# Altium project Power Distribution Board.PrjPcb (part 1 of 2)
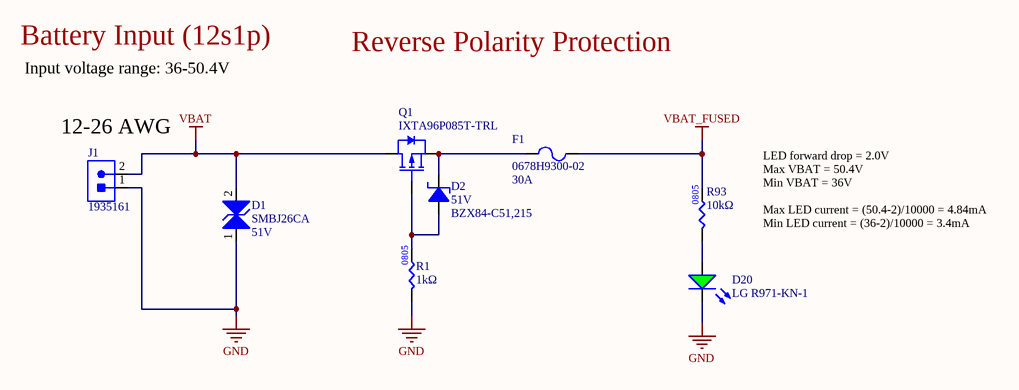
[diagram p0: SH1 - POWER.SchDoc]
11 sheets, 242 parts. Net scope: flat (ports and power ports of the same name join across sheets).
Board files: Power Distribution Board.PcbDoc, High Speed Sample.PcbDoc
Sheets:
  SH1 - POWER.SchDoc
  SH2 - 17V BUCK CONVERTER.SchDoc
  SH3 - 5V BUCK CONVERTER.SchDoc
  SH4 - 3.3V LINEAR REGULATOR.SchDoc
  SH5 - LOAD MONITORING 1.SchDoc
  SH6 - LOAD MONITORING 2.SchDoc
  SH7 - MICROCONTROLLER.SchDoc
  SH8 - CAN.SchDoc
  SH9 - RS-485.SchDoc
  SH10 - BMS.SchDoc
  SH11 - Battery Balancing.SchDoc

## Sheet SH1 - POWER.SchDoc: Power
size B; CheckedBy: Cindy Li; Engineer: Farris Matar; Organization: UW Robotics; Address1: 200 University Avenue; Address2: Waterloo; Address3: Ontario; Address4: Canada N2L 3G6; DocumentNumber: 1; Revision: 3; SheetNumber: 1; SheetTotal: 9

### Parts
D1  Manufacturer Part Number 1: SMBJ26CA  Voltage - Reverse Standoff (Typ): 51V  [TVS_DIODE_BIDIR_SMB]  (hidden comment: TVS_DIODE_BIDIR_51V)
D2  Manufacturer Part Number 1: BZX84-C51,215  Working Voltage: 51V  [SOT23-3]  (hidden comment: DIO_ZENER_51V)
D20  Manufacturer Part Number 1: LG R971-KN-1  [LED_0805_GREEN]  (hidden comment: LED_GREEN)
F1  Manufacturer Part Number 1: 0678H9300-02  Current Rating: 30A  [FUSE_3912]  (hidden comment: FUSE_30A_3912)
J1  CON_2M_TERM  [1935161]  (value not drawn)
Q1  Manufacturer Part Number 1: IXTA96P085T-TRL  [D-PAK]  (hidden comment: PMOS_85V_96A)
R1  value 1kΩ  [RES0805]  (hidden comment: RES_1kΩ_0805_1%)
R93  value 10kΩ  [RES0805]  (hidden comment: RES_10kΩ_0805_5%)

### Nets
GND: D1.1 D20.2(K) J1.1 R1.1  [project net AGND]
VBAT: D1.2 J1.2 Q1.1(Drain)
VBAT_FUSED: F1.2 R93.2
NetD2_1: D2.1(Anode) Q1.2(Gate) R1.2
NetD2_3: D2.3(Cathode) F1.1 Q1.3(Source)
NetD20_1: D20.1(A) R93.1

### Notes on the sheet
- Battery Input (12s1p)
- Input voltage range: 36-50.4V
- Reverse Polarity Protection
- (near J1) 12-26 AWG
- LED forward drop = 2.0V
  Max VBAT = 50.4V
  Min VBAT = 36V
  Max LED current = (50.4-2)/10000 = 4.84mA
  Min LED current = (36-2)/10000 = 3.4mA
- Title:
- Project:
- Date:
- Rev:
- Reviewer:
- Engineer:
- Sheet:
- of

### Library data of the parts
D1 = TVS_DIODE_BIDIR_51V: TVS DIODE 51VWM 82.4VC DO214AA; Manufacturer 1: Littelfuse; Package/Footprint: SMB; Voltage - Clamping (Max) @ Ipp: 82.4V; Voltage - Breakdown (Min): 56.7V; Supplier 1: Digi-Key; Supplier Part Number 1: SMBJ51CALFCT-ND; Mounting Type: SMD
D2 = DIO_ZENER_51V: DIODE ZENER 51V 250MW TO236AB; Manufacturer 1: Nexperia USA Inc.; Forward Voltage: 0.9V; Supplier Part Number 1: 1727-5037-1-ND; Supplier 1: Digi-Key; Package/Case: SOT-23-3
D20 = LED_GREEN: LED GREEN DIFFUSED 0805 SMD; Manufacturer 1: OSRAM; Forward Voltage Drop: 2.2V; Package/Footprint: 0805; Supplier Part Number 1: 475-1410-1-ND; Supplier 1: Digi-Key; Mounting Type: SMD
F1 = FUSE_30A_3912: FUSE SMT 3912 ENH BRK 250V 30A; Manufacturer 1: Bel Fuse Inc.; Package/Footprint: 3912; Supplier 1: Digi-Key; Supplier Part Number 1: 507-2254-1-ND; Mounting Type: SMD; Verified: No
J1 = CON_2M_TERM: TERM BLK 2POS SIDE ENTRY 5MM; Manufacturer 1: Phoenix Contact; Voltage: 300V; Current: 18A; Max Current Rating: 16A; Package/Footprint: SMD; Supplier 1: Digi-Key; Manufacturer Part Number 1: 1935161; Supplier Part Number 1: 277-1667-ND; Mounting Type: TH
Q1 = PMOS_85V_96A: MOSFET P-CH 85V 96A TO263; Manufacturer 1: IXYS; Package/Footprint: TO-263AA; Vgs (Max): ±15V; Mounting Type: SMD; Verified: No; Supplier 1: Digi-Key; Supplier Part Number 1: IXTA96P085T-TRLCT-ND; Id: 96A; Vdss: 85V
R1 = RES_1kΩ_0805_1%: RES 1K OHM 1% 1/8W 0805; Manufacturer 1: Yageo; Manufacturer Part Number 1: RC0805FR-071KL; Package: 0805; Supplier Part Number 1: 311-1.00KCRCT-ND; Supplier 1: Digi-Key; Mounting Type: SMD; LCSC Part #: C17513
R93 = RES_10kΩ_0805_5%: RES 10K OHM 5% 1/8W 0805; Manufacturer 1: Panasonic Electronic Components; Manufacturer Part Number 1: ERJ-6GEYJ103V; Package/Footprint: 0805; Supplier Part Number 1: P10KACT-ND; Supplier 1: Digi-Key; LCSC Part #: C17414; Mounting Type: SMD

## Sheet SH2 - 17V BUCK CONVERTER.SchDoc: 17V Buck Converter
size B; CheckedBy: Cindy Li; Engineer: Farris Matar; Organization: UW Robotics; Address1: 200 University Avenue; Address2: Waterloo; Address3: Ontario; Address4: Canada N2L 3G6; DocumentNumber: 2; Revision: 3; SheetNumber: 2; SheetTotal: 9
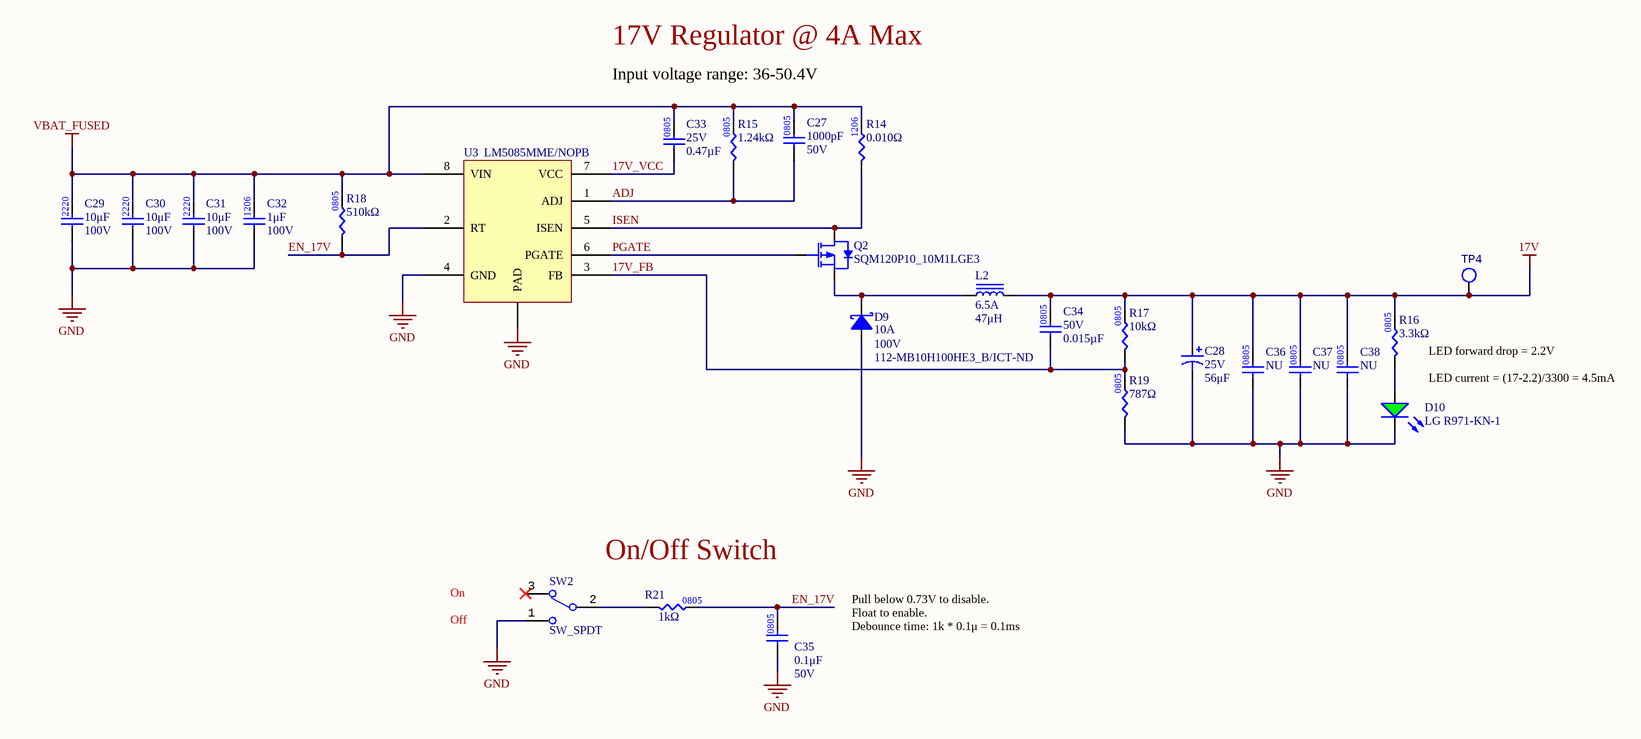
[diagram p1: SH2 - 17V BUCK CONVERTER.SchDoc]

### Parts
C27  value 1000pF  Voltage Rating: 50V  [CAP2012]  (hidden comment: CAP_1000pF_50V_0805)
C28  value 56μF  Voltage Rating: 25V  [RADIAL_PANASONIC_D]  (hidden comment: CAP_56uF_25V_ALUM)
C29  value 10μF  Voltage Rating: 100V  [CAP2220]  (hidden comment: CAP_10μF_100V_2220)
C30  value 10μF  Voltage Rating: 100V  [CAP2220]  (hidden comment: CAP_10μF_100V_2220)
C31  value 10μF  Voltage Rating: 100V  [CAP2220]  (hidden comment: CAP_10μF_100V_2220)
C32  value 1μF  Voltage Rating: 100V  [CAPC3216X190X50NL20T25]  (hidden comment: CAP_1uF_100V_1206)
C33  value 0.47µF  Voltage Rating: 25V  [CAP0805]  (hidden comment: CAP_0.47uF_25V_0805)
C34  value 0.015µF  Voltage Rating: 50V  [CAP0805]  (hidden comment: CAP_0.015uF_50V_0805)
C35  value 0.1μF  Voltage Rating: 50V  [CAP2012]  (hidden comment: CAP_0.1uF_50V_0805)
C36  value NU  [CAP0805]  (hidden comment: CAP_NU_0805)
C37  value NU  [CAP0805]  (hidden comment: CAP_NU_0805)
C38  value NU  [CAP0805]  (hidden comment: CAP_NU_0805)
D9  Vr (Max): 100V  Supplier Part Number 1: 112-MB10H100HE3_B/ICT-ND  Forward Current: 10A  [D-PAK3]  (hidden comment: DIO_SCHOTTKY_100V_5.5A)
D10  Manufacturer Part Number 1: LG R971-KN-1  [LED_0805_GREEN]  (hidden comment: LED_GREEN)
L2  Current Rating: 6.5A  Inductance: 47μH  [IND_BOURNS_SRP1265]  (hidden comment: IND_47uH_6.5A)
Q2  Manufacturer Part Number 1: SQM120P10_10M1LGE3  [D-PAK]  (hidden comment: PMOS_100V_120A)
R14  value 0.010Ω  [RES1206]  (hidden comment: RES_0.010Ω_1206_1%)
R15  value 1.24kΩ  [RES0805]  (hidden comment: RES_1.24kΩ_0805_1%)
R16  value 3.3kΩ  [RES0805]  (hidden comment: RES_3.3kΩ_0805_1%)
R17  value 10kΩ  [RES0805]  (hidden comment: RES_10kΩ_0805_5%)
R18  value 510kΩ  [RES0805]  (hidden comment: RES_510kΩ_0805_1%)
R19  value 787Ω  [RES0805]  (hidden comment: RES_787Ω_0805_1%)
R21  value 1kΩ  [RES0805]  (hidden comment: RES_1kΩ_0805_1%_1)
SW2  SW_SPDT  [100SP1T1B4M2QE]
TP4  TESTPOINT_LOOP  [TESTPOINT_LOOP]  (value not drawn)
U3  Manufacturer Part Number 1: LM5085MME/NOPB  [8-VSSOP]  (hidden comment: BUCK_LMR14050SDDAR)

### Nets
17V: C28.1 C34.2 C36.2 C37.2 C38.2 L2.2 R16.2 R17.2 TP4.1
GND: C28.2 C29.1 C30.1 C31.1 C32.1 C35.1 C36.1 C37.1 C38.1 D9.1(Anode) D10.2(K) R19.1 SW2.1 U3.4(GND) U3.9(PAD)  [project net AGND]
VBAT_FUSED: C27.2 C29.2 C30.2 C31.2 C32.2 C33.2 R14.2 R15.2 R18.2 U3.8(VIN)
17V_FB: C34.1 R17.1 R19.2 U3.3(FB)
17V_VCC: C33.1 U3.7(VCC)
ADJ: C27.1 R15.1 U3.1(ADJ)
EN_17V: C35.2 R18.1 R21.2 U3.2(RT)
ISEN: Q2.1(Drain) R14.1 U3.5(ISEN)
PGATE: Q2.2(Gate) U3.6(PGATE)
NetD9_2: D9.2(Cathode) L2.1 Q2.3(Source)
NetD10_1: D10.1(A) R16.1
NetR21_1: R21.1 SW2.2

Not connected (* = marked no-connect by the designer): SW2 3*

### Notes on the sheet
- Input voltage range: 36-50.4V
- 17V Regulator @ 4A Max
- LED forward drop = 2.2V
  LED current = (17-2.2)/3300 = 4.5mA
- Off
- On
- On/Off Switch
- Pull below 0.73V to disable.
  Float to enable.
  Debounce time: 1k * 0.1μ = 0.1ms
- Title:
- Project:
- Date:
- Rev:
- Reviewer:
- Engineer:
- Sheet:
- of

### Library data of the parts
C27 = CAP_1000pF_50V_0805: CAP CER 1000pF 50V X7R 0805; Manufacturer 1: Samsung; Manufacturer Part Number 1: CL21B102KBANNNC; Package/Footprint: 0805; Supplier 1: Digi-Key; Mounting Type: SMD; Supplier Part Number 1: 1276-1020-1-ND; Dielectric: X7R
C28 = CAP_56uF_25V_ALUM: CAP ALUM POLY HYB 56UF 25V SMD; Manufacturer Part Number 1: EEH-ZC1E560P; Manufacturer 1: Panasonic Electronic Components; Supplier 1: Digi-Key; Supplier Part Number 1: P15460CT-ND
C29-C31 = CAP_10μF_100V_2220: CAP CER 10UF 100V X7S 2220; Manufacturer 1: TDK Corporation; Manufacturer Part Number 1: CGA9N3X7S2A106K230KE; Mounting Type: SMD; Package: 2220; Supplier 1: Digi-Key; Supplier Part Number 1: 445-8768-1-ND
C32 = CAP_1uF_100V_1206: CAP CER 1UF 100V X7R 1206; Supplier 1: Digi-Key; Mounting Type: SMD; Package: 1206; Supplier Part Number 1: 490-16468-1-ND
C33 = CAP_0.47uF_25V_0805: CAP CER 0.47UF 25V X5R 0805; Manufacturer 1: KEMET; Manufacturer Part Number 1: C0805C474K3PAC7800; Package: 0805; Supplier 1: Digi-Key; Supplier Part Number 1: 399-15508-1-ND
C34 = CAP_0.015uF_50V_0805: CAP CER 0.015UF 50V C0G 0805; Manufacturer 1: TDK Corporation; Manufacturer Part Number 1: CGA4F2C0G1H153J085AA; Package: 0805; Supplier 1: Digi-Key; Supplier Part Number 1: 445-6948-1-ND
C35 = CAP_0.1uF_50V_0805: CAP CER 0.1UF 50V X7R 0805; Manufacturer Part Number 1: GCM21BR71H104KA37K; Manufacturer 1: Murata Electronics; Package/Footprint: 0805; Supplier Part Number 1: 490-8049-1-ND; Supplier 1: Digi-Key; Dielectric: X7R; LCSC Part #: C49678; Mounting Type: SMD
C36-C38 = CAP_NU_0805: PLACEHOLDER CAPACITOR; Mounting Type: SMD; Package: 0805
D9 = DIO_SCHOTTKY_100V_10A: DIODE SCHOTTKY 100V 10A TO263AB; Manufacturer 1: Vishay General Semiconductor - Diodes Division; Manufacturer Part Number 1: MB10H100HE3_B/I; Package/Footprint: TO-263AB; Mounting Type: SMD; Supplier 1: Digi-Key
D10 = LED_GREEN: as D20 on sheet SH1 - POWER; Supplier Part Number 1: 475-1410-1-ND; Supplier 1: Digi-Key; Mounting Type: SMD
L2 = IND_47uH_6.5A: FIXED IND 47UH 6.5A 90 MOHM SMD; Manufacturer 1: Bourns Inc.; Manufacturer Part Number 1: SRP1265A-470M; DC Resistance (DCR): 90mR; Saturation Current: 9A; Supplier 1: Digi-Key; Supplier Part Number 1: SRP1265A-470MCT-ND
Q2 = PMOS_100V_120A: MOSFET P-CH 100V 120A TO263; Manufacturer 1: Vishay Siliconix; Package/Footprint: TO-263; Vgs (Max): ±15V; Mounting Type: SMD; Verified: No; Id: 120A; Vdss: 100V; Supplier 1: Digi-Key; Supplier Part Number 1: IXTA96P085T-ND
R14 = RES_0.010Ω_1206_1%: RES 0.01 OHM 1% 1/2W 1206; Manufacturer 1: Stackpole Electronics Inc; Manufacturer Part Number 1: CSR1206FT10L0; Package/Footprint: 1206; Mounting Type: SMD; Supplier 1: Digi-Key; Supplier Part Number 1: CSR1206FT10L0CT-ND
R15 = RES_1.24kΩ_0805_1%: RES 1.24K OHM 1% 1/8W 0805; Manufacturer 1: Stackpole Electronics Inc; Manufacturer Part Number 1: RMCF0805FT1K24; Package/Footprint: 0805; Mounting Type: SMD; Supplier 1: Digi-Key; Supplier Part Number 1: RMCF0805FT1K24CT-ND
R16 = RES_3.3kΩ_0805_1%: RES 3.3K OHM 1% 1/8W 0805; Manufacturer 1: Vishay Dale; Manufacturer Part Number 1: CRCW06033K30FKEA; Mounting Type: SMD; Supplier 1: Digi-Key; Supplier Part Number 1: 541-3.30KHCT-ND; LCSC Part #: C26010; Package: 0805
R17 = RES_10kΩ_0805_5%: as R93 on sheet SH1 - POWER; Supplier 1: Digi-Key; Supplier Part Number 1: P10KACT-ND; LCSC Part #: C17414; Mounting Type: SMD
R18 = RES_510kΩ_0805_1%: RES 510K OHM 5% 1/8W 0805; Manufacturer 1: Stackpole Electronics Inc; Manufacturer Part Number 1: RMCF0805JT510K; Package/Footprint: 0805; Mounting Type: SMD; Supplier 1: Digi-Key; Supplier Part Number 1: RMCF0805JT510KCT-ND
R19 = RES_787Ω_0805_1%: RES 787 OHM 1% 1/8W 0805; Manufacturer 1: Yageo; Manufacturer Part Number 1: RC0805FR-07787RL; Package/Footprint: 0805; Mounting Type: SMD; Supplier 1: Digi-Key; Supplier Part Number 1: RHM.005APCT-ND
R21 = RES_1kΩ_0805_1%_1: RES 1K OHM 1% 1/8W 0805; Manufacturer 1: Yageo; Manufacturer Part Number 1: RC0805FR-071KL; Supplier Part Number 1: 311-1.00KCRCT-ND; Supplier 1: Digi-Key; LCSC Part #: C17513; Mounting Type: SMD; Package: 0805
SW2 = SW_SPDT: SWITCH TOGGLE SPDT 5A 120V; Manufacturer 1: E-Switch; Voltage Rating (DC): 28V; Package/Footprint: TH; Supplier 1: Digi-Key; Manufacturer Part Number 1: 100SP1T1B4M2QE; Throw Configuration: SPDT; Supplier Part Number 1: EG2355-ND; Current Rating: 5A; Mounting Type: TH
TP4 = TESTPOINT_LOOP: TESTPOINT THRUHOLE; Manufacturer 1: Keystone Electronics; Manufacturer Part Number 1: 5002; Package/Footprint: TH; Supplier Part Number 1: 36-5002-ND; Supplier 1: Digi-Key; Mounting Type: TH
U3 = BUCK_LM5085: IC REG CTRLR BUCK 8VSSOP; Manufacturer 1: Texas Instruments; Output Type: Transistor Driver; Output Configuration: Positive; Package/Footprint: 8-VSSON; Mounting Type: SMD; Supplier 1: Digi-Key; Supplier Part Number 1: LM5085MME/NOPBCT-ND

## Sheet SH3 - 5V BUCK CONVERTER.SchDoc: 5V Buck Converter
size B; CheckedBy: Cindy Li; Engineer: Farris Matar; Organization: UW Robotics; Address1: 200 University Avenue; Address2: Waterloo; Address3: Ontario; Address4: Canada N2L 3G6; DocumentNumber: 3; Revision: 3; SheetNumber: 3; SheetTotal: 9
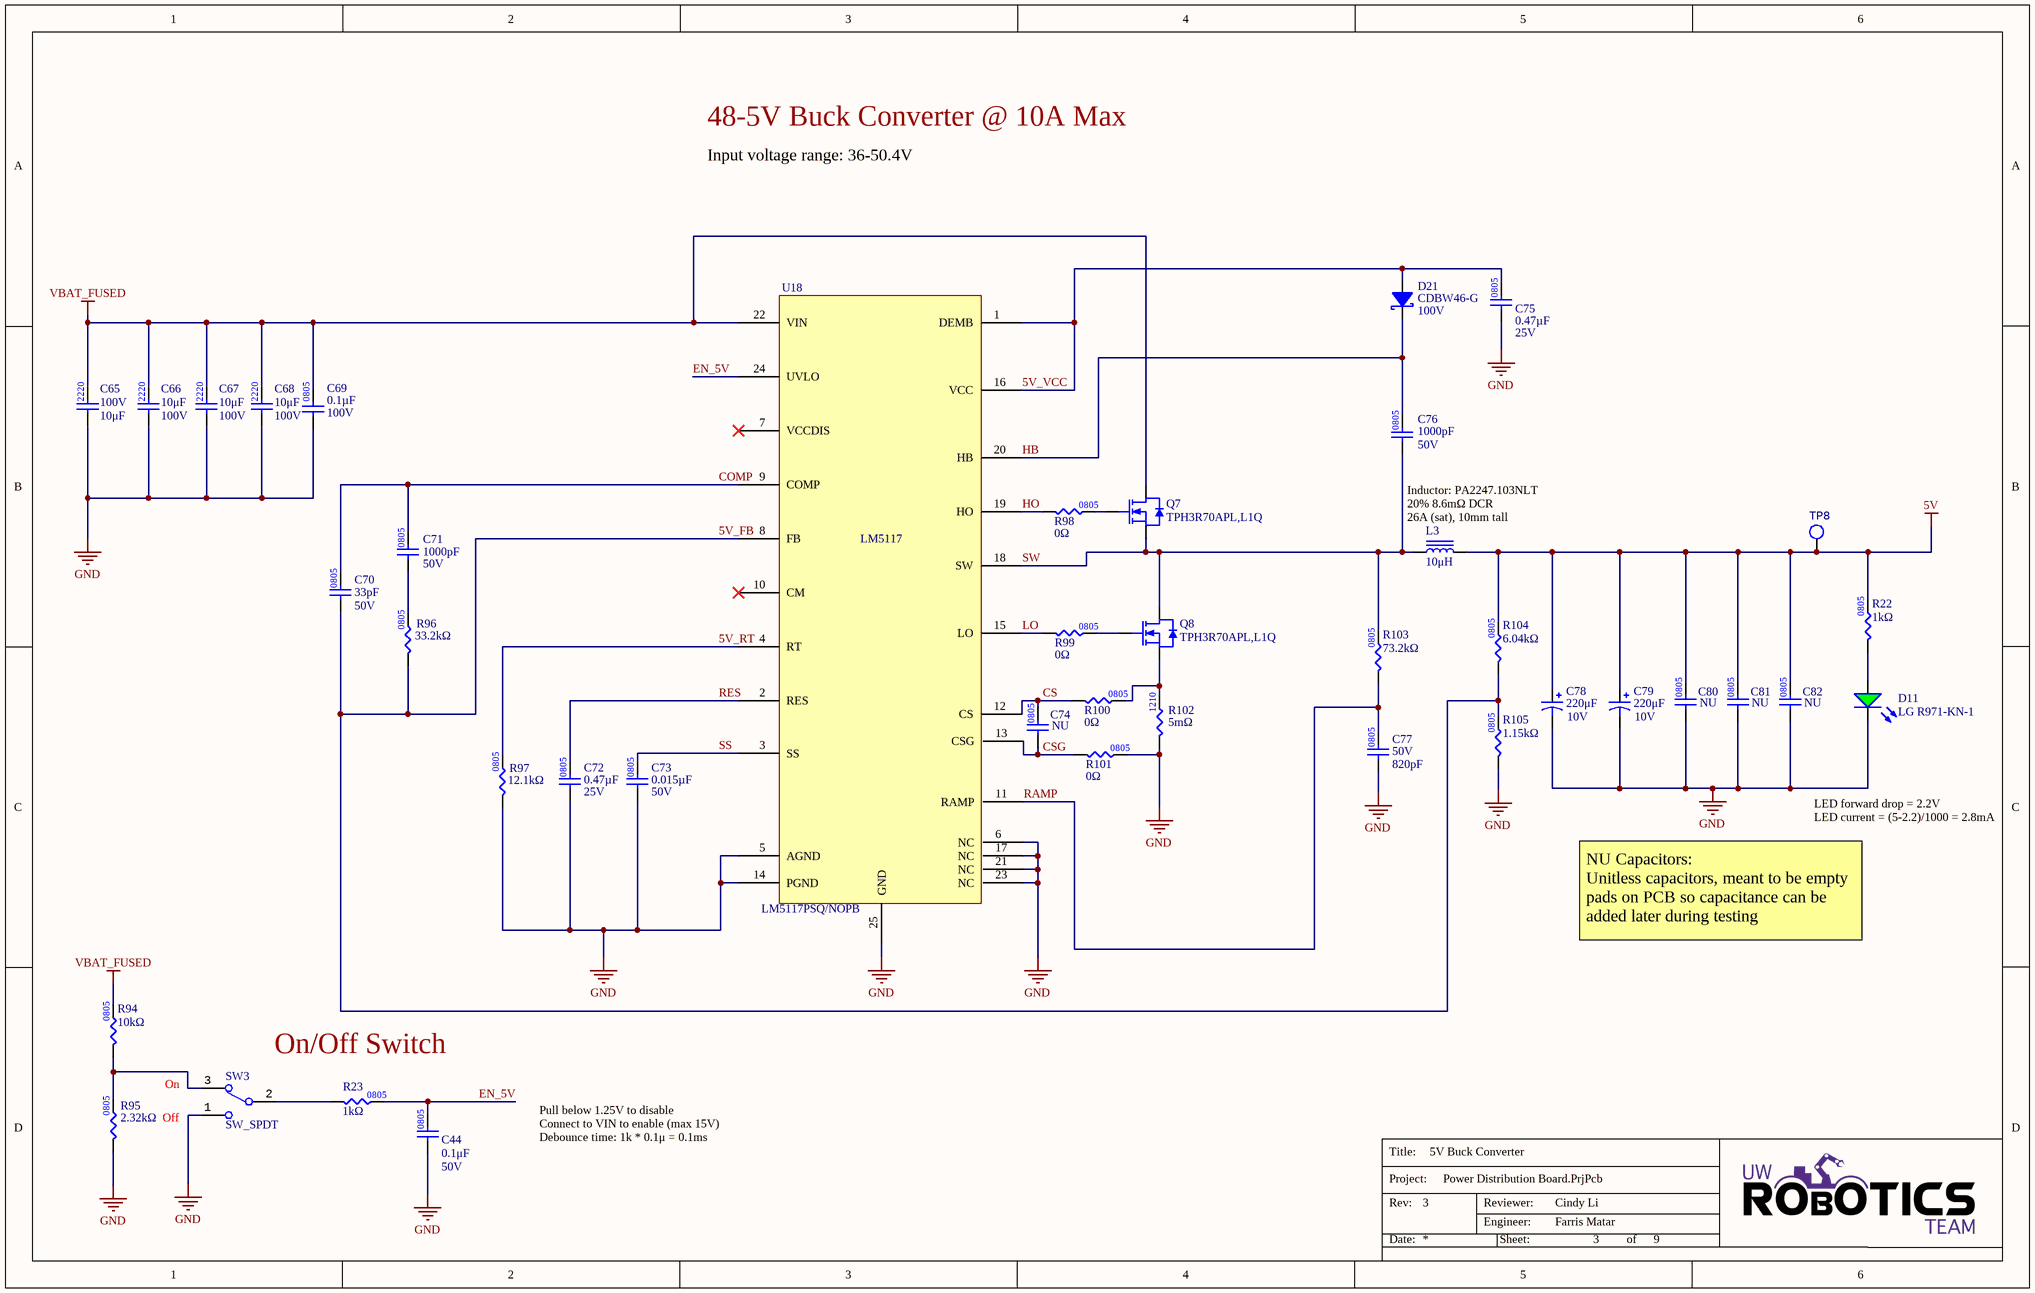
[diagram p2: SH3 - 5V BUCK CONVERTER.SchDoc]

### Parts
C44  value 0.1μF  Voltage Rating: 50V  [CAP2012]  (hidden comment: CAP_0.1uF_50V_0805)
C65  value 10μF  Voltage Rating: 100V  [CAP2220]  (hidden comment: CAP_10μF_100V_2220)
C66  value 10μF  Voltage Rating: 100V  [CAP2220]  (hidden comment: CAP_10μF_100V_2220)
C67  value 10μF  Voltage Rating: 100V  [CAP2220]  (hidden comment: CAP_10μF_100V_2220)
C68  value 10μF  Voltage Rating: 100V  [CAP2220]  (hidden comment: CAP_10μF_100V_2220)
C69  value 0.1µF  Voltage Rating: 100V  [CAP0805]  (hidden comment: CAP_0.1uF_100V_0805)
C70  value 33pF  Voltage Rating: 50V  [CAP0805]  (hidden comment: CAP_33pF_50V_0805)
C71  value 1000pF  Voltage Rating: 50V  [CAP2012]  (hidden comment: CAP_1000pF_50V_0805)
C72  value 0.47µF  Voltage Rating: 25V  [CAP0805]  (hidden comment: CAP_0.47uF_25V_0805)
C73  value 0.015µF  Voltage Rating: 50V  [CAP0805]  (hidden comment: CAP_0.015uF_50V_0805)
C74  value NU  [CAP0805]  (hidden comment: CAP_NU_0805)
C75  value 0.47µF  Voltage Rating: 25V  [CAP0805]  (hidden comment: CAP_0.47uF_25V_0805)
C76  value 1000pF  Voltage Rating: 50V  [CAP2012]  (hidden comment: CAP_1000pF_50V_0805)
C77  Voltage Rating: 50V  Capacitance: 820pF  [CAP0805]  (hidden comment: CAP_820pF_50V_0805)
C78  value 220μF  Voltage Rating: 10V  [CAP2917]  (hidden comment: CAP_220uF_10V_TANT)
C79  value 220μF  Voltage Rating: 10V  [CAP2917]  (hidden comment: CAP_220uF_10V_TANT)
C80  value NU  [CAP0805]  (hidden comment: CAP_NU_0805)
C81  value NU  [CAP0805]  (hidden comment: CAP_NU_0805)
C82  value NU  [CAP0805]  (hidden comment: CAP_NU_0805)
D11  Manufacturer Part Number 1: LG R971-KN-1  [LED_0805_GREEN]  (hidden comment: LED_GREEN)
D21  Manufacturer Part Number 1: CDBW46-G  Vr (Max): 100V  [SOD-123_FLAT]  (hidden comment: DIO_SCHOTTKY_100V_150mA)
L3  Inductance: 10μH  [IND_PULSE_PA2247]  (hidden comment: IND_10uH_24A)
Q7  Manufacturer Part Number 1: TPH3R70APL,L1Q  [8-SOP ADVANCE]  (hidden comment: NMOS_100V_90A)
Q8  Manufacturer Part Number 1: TPH3R70APL,L1Q  [8-SOP ADVANCE]  (hidden comment: NMOS_100V_90A)
R22  value 1kΩ  [RES0805]  (hidden comment: RES_1kΩ_0805_1%_1)
R23  value 1kΩ  [RES0805]  (hidden comment: RES_1kΩ_0805_1%)
R94  value 10kΩ  [RES0805]  (hidden comment: RES_10kΩ_0805_5%)
R95  value 2.32kΩ  [RES0805]  (hidden comment: RES_2.32kΩ_0805_1%)
R96  value 33.2kΩ  [RES0603]  (hidden comment: RES_33.2kΩ_0805_1%)
R97  value 12.1kΩ  [RES0805]  (hidden comment: RES_12.1kΩ_0805_1%)
R98  value 0Ω  [RES0805]  (hidden comment: RES_0Ω_0805)
R99  value 0Ω  [RES0805]  (hidden comment: RES_0Ω_0805)
R100  value 0Ω  [RES0805]  (hidden comment: RES_0Ω_0805)
R101  value 0Ω  [RES0805]  (hidden comment: RES_0Ω_0805)
R102  value 5mΩ  [RES1210]  (hidden comment: RES_5mΩ_1210_1%)
R103  value 73.2kΩ  [RES0603]  (hidden comment: RES_73.2kΩ_0805_1%)
R104  value 6.04kΩ  [RES0805]  (hidden comment: RES_6.04kΩ_0805_1%)
R105  value 1.15kΩ  [RES0805]  (hidden comment: RES_1.15kΩ_0805_1%)
SW3  SW_SPDT  [100SP1T1B4M2QE]
TP8  TESTPOINT_LOOP  [TESTPOINT_LOOP]  (value not drawn)
U18  Manufacturer Part Number 1: LM5117PSQ/NOPB  [24-WQFN]  (hidden comment: BUCK_LM5117QFN)

### Nets
5V: C78.1 C79.1 C80.2 C81.2 C82.2 L3.2 R22.2 R104.2 TP8.1
GND: C44.1 C65.1 C66.1 C67.1 C68.1 C69.1 C72.1 C73.1 C75.1 C77.1 C78.2 C79.2 C80.1 C81.1 C82.1 D11.2(K) R95.1 R97.1 R101.2 R102.1 R105.1 SW3.1 U18.5(AGND) U18.6(NC) U18.14(PGND) U18.17(NC) U18.21(NC) U18.23(NC) U18.25(GND)  [project net AGND]
VBAT_FUSED: C65.2 C66.2 C67.2 C68.2 C69.2 Q7.3(Drain) R94.2 U18.22(VIN)
5V_FB: C70.1 R96.1 R104.1 R105.2 U18.8(FB)
5V_RT: R97.2 U18.4(RT)
5V_VCC: C75.2 D21.2(Anode) U18.1(DEMB) U18.16(VCC)
COMP: C70.2 C71.2 U18.9(COMP)
CS: C74.2 R100.1 U18.12(CS)
CSG: C74.1 R101.1 U18.13(CSG)
EN_5V: C44.2 R23.2 U18.24(UVLO)
HB: C76.2 D21.1(Cathode) U18.20(HB)
HO: R98.1 U18.19(HO)
LO: R99.1 U18.15(LO)
RAMP: C77.2 R103.1 U18.11(RAMP)
RES: C72.2 U18.2(RES)
SS: C73.2 U18.3(SS)
SW: C76.1 L3.1 Q7.2(Source) Q8.3(Drain) R103.2 U18.18(SW)
NetC71_1: C71.1 R96.2
NetD11_1: D11.1(A) R22.1
NetQ7_1: Q7.1(Gate) R98.2
NetQ8_1: Q8.1(Gate) R99.2
NetQ8_2: Q8.2(Source) R100.2 R102.2
NetR23_1: R23.1 SW3.2
NetR94_1: R94.1 R95.2 SW3.3

Not connected (* = marked no-connect by the designer): U18 7(VCCDIS)* 10(CM)*

### Notes on the sheet
- 48-5V Buck Converter @ 10A Max
- Input voltage range: 36-50.4V
- Inductor: PA2247.103NLT
- 20% 8.6mΩ DCR
- (near L3) 26A (sat), 10mm tall
- LED forward drop = 2.2V
  LED current = (5-2.2)/1000 = 2.8mA
- NU Capacitors:
  Unitless capacitors, meant to be empty
  pads on PCB so capacitance can be
  added later during testing
- On
- On/Off Switch
- Off
- Pull below 1.25V to disable
  Connect to VIN to enable (max 15V)
  Debounce time: 1k * 0.1μ = 0.1ms
- Title:
- Project:
- Date:
- Rev:
- Reviewer:
- Engineer:
- Sheet:
- of
- (in symbol BUCK_LM5117QFN) LM5117

### Library data of the parts
C44 = CAP_0.1uF_50V_0805: as C35 on sheet SH2 - 17V BUCK CONVERTER; Supplier Part Number 1: 490-8049-1-ND; Supplier 1: Digi-Key; Dielectric: X7R; LCSC Part #: C49678; Mounting Type: SMD
C65-C68 = CAP_10μF_100V_2220: as C29 on sheet SH2 - 17V BUCK CONVERTER; Mounting Type: SMD; Supplier 1: Digi-Key; Supplier Part Number 1: 445-8768-1-ND; Package: 2220
C69 = CAP_0.1uF_100V_0805: CAP CER 0.1UF 100V X7R 0805; Manufacturer 1: TDK Corporation; Manufacturer Part Number 1: C2012X7R2A104K125AA; Supplier 1: Digi-Key; Supplier Part Number 1: 445-1418-1-ND; Package: 0805
C70 = CAP_33pF_50V_0805: CAP CER 33PF 50V C0G/NP0 0805; Manufacturer 1: Samsung Electro-Mechanics; Manufacturer Part Number 1: CL21C330JBANNNC; Supplier 1: Digi-Key; Supplier Part Number 1: 1276-1105-1-ND; Dielectric: C0G/NP0; Mounting Type: SMD; Package: 0805
C71 C76 = CAP_1000pF_50V_0805: as C27 on sheet SH2 - 17V BUCK CONVERTER; Supplier 1: Digi-Key; Supplier Part Number 1: 1276-1020-1-ND; Mounting Type: SMD; Dielectric: X7R
C72 C75 = CAP_0.47uF_25V_0805: as C33 on sheet SH2 - 17V BUCK CONVERTER; Supplier 1: Digi-Key; Supplier Part Number 1: 399-15508-1-ND; Package: 0805
C73 = CAP_0.015uF_50V_0805: as C34 on sheet SH2 - 17V BUCK CONVERTER; Supplier 1: Digi-Key; Supplier Part Number 1: 445-6948-1-ND; Package: 0805
C74 C80-C82 = CAP_NU_0805: PLACEHOLDER CAPACITOR; Mounting Type: SMD; Package: 0805
C77 = CAP_820pF_50V_0805: CAP CER 820PF 50V C0G/NP0 0805; Manufacturer 1: KEMET; Manufacturer Part Number 1: C0805X821J5GAC7800; Package/Footprint: 0805; Supplier 1: Digi-Key; Supplier Part Number 1: 399-19481-1-ND
C78 C79 = CAP_220uF_10V_TANT: CAP TANT POLY 220UF 10V 2917; Manufacturer 1: Vishay Sprague; Manufacturer Part Number 1: T55D227M010C0008; Supplier 1: Digi-Key; Supplier Part Number 1: 718-2303-1-ND
D11 = LED_GREEN: as D20 on sheet SH1 - POWER; Supplier Part Number 1: 475-1410-1-ND; Supplier 1: Digi-Key; Mounting Type: SMD
D21 = DIO_SCHOTTKY_100V_150mA: DIODE SCHOTTKY 100V 150MA SOD123; Manufacturer 1: Comchip Technology; Package/Footprint: SOD-123; Mounting Type: SMD; Supplier 1: Digi-Key; Supplier Part Number 1: 641-1964-1-ND
L3 = IND_10uH_24A: FIXED IND 10UH 24A 8.6 MOHM SMD; Manufacturer 1: Pulse Electronics Power; Manufacturer Part Number 1: PA2247.103NLT; DC Resistance (DCR): 8.6mR; Saturation Current: 26A; Current Rating: 24A; Supplier 1: Digi-Key; Supplier Part Number 1: 553-PA2247.103NLTCT-ND
Q7 Q8 = NMOS_100V_90A: MOSFET N-CH 100V 90A 8SOP; Manufacturer 1: Toshiba Semiconductor and Storage; Vgs (Max): ±20V; Supplier 1: Digi-Key; Supplier Part Number 1: 264-TPH3R70APLL1QCT-ND; Vdss: 100V; Package/Footprint: 8-SOP Advance; Id: 90A
R22 = RES_1kΩ_0805_1%_1: as R21 on sheet SH2 - 17V BUCK CONVERTER; Supplier 1: Digi-Key; Mounting Type: SMD; Supplier Part Number 1: 311-1.00KCRCT-ND; LCSC Part #: C17513; Package: 0805
R23 = RES_1kΩ_0805_1%: as R1 on sheet SH1 - POWER; Supplier Part Number 1: 311-1.00KCRCT-ND; Supplier 1: Digi-Key; Mounting Type: SMD; LCSC Part #: C17513; Package: 0805
R94 = RES_10kΩ_0805_5%: as R93 on sheet SH1 - POWER; Supplier 1: Digi-Key; Supplier Part Number 1: P10KACT-ND; LCSC Part #: C17414; Mounting Type: SMD
R95 = RES_2.32kΩ_0805_1%: RES 2.32K OHM 1% 1/4W 0805; Manufacturer 1: Stackpole Electronics Inc; Manufacturer Part Number 1: RNCP0805FTD2K32; Supplier 1: Digi-Key; Supplier Part Number 1: RNCP0805FTD2K32CT-ND; Package: 0805
R96 = RES_33.2kΩ_0805_1%: RES 33.2K OHM 1% 1/8W 0805; Manufacturer 1: Stackpole Electronics Inc; Manufacturer Part Number 1: RMCF0805FT33K2; Package/Footprint: 0805; Supplier 1: Digi-Key; Supplier Part Number 1: RMCF0805FT33K2CT-ND; Mounting Type: SMD
R97 = RES_12.1kΩ_0805_1%: RES 12.1K OHM 1% 1/4W 0805; Manufacturer 1: Stackpole Electronics Inc; Manufacturer Part Number 1: RNCP0805FTD12K1; Supplier 1: Digi-Key; Supplier Part Number 1: RNCP0805FTD12K1CT-ND; Package: 0805
R98-R101 = RES_0Ω_0805: RES 0 OHM JUMPER 1/8W 0805; Manufacturer 1: Panasonic Electronic Components; Manufacturer Part Number 1: ERJ-6GEY0R00V; Package/Footprint: 0805; Supplier Part Number 1: P0.0ACT-ND; Supplier 1: Digi-Key; Mounting Type: SMD; LCSC Part #: C17477
R102 = RES_5mΩ_1210_1%: RES 0.005 OHM 1% 1W 1210; Manufacturer 1: Rohm Semiconductor; Manufacturer Part Number 1: PMR25HZPFU5L00; Package/Footprint: 1210; Supplier 1: Digi-Key; Supplier Part Number 1: RHM.005APCT-ND; Mounting Type: SMD
R103 = RES_73.2kΩ_0805_1%: RES 73.2K OHM 1% 1/8W 0805; Manufacturer 1: Yageo; Manufacturer Part Number 1: RC0805FR-0773K2L; Package/Footprint: 0805; Mounting Type: SMD; Supplier 1: Digi-Key; Supplier Part Number 1: 311-73.2KCRCT-ND
R104 = RES_6.04kΩ_0805_1%: RES 6.04K OHM 1% 1/8W 0805; Manufacturer 1: Yageo; Manufacturer Part Number 1: RC0805FR-076K04L; Package/Footprint: 0805; Supplier 1: Digi-Key; Supplier Part Number 1: 311-6.04KCRCT-ND; Mounting Type: SMD
R105 = RES_1.15kΩ_0805_1%: RES 1.15K OHM 1% 1/8W 0805; Manufacturer 1: Yageo; Manufacturer Part Number 1: RC0805FR-071K15L; Package/Footprint: 0805; Supplier 1: Digi-Key; Supplier Part Number 1: 311-1.15KCRCT-ND; Mounting Type: SMD
SW3 = SW_SPDT: as SW2 on sheet SH2 - 17V BUCK CONVERTER; Supplier 1: Digi-Key; Manufacturer Part Number 1: 100SP1T1B4M2QE; Throw Configuration: SPDT; Supplier Part Number 1: EG2355-ND; Current Rating: 5A; Mounting Type: TH
TP8 = TESTPOINT_LOOP: as TP4 on sheet SH2 - 17V BUCK CONVERTER; Supplier Part Number 1: 36-5002-ND; Supplier 1: Digi-Key; Mounting Type: TH
U18 = BUCK_LM5117QFN: IC REG CTRLR BUCK 24WQFN; Manufacturer 1: Texas Instruments; Mounting Type: SMD; Package/Footprint: 24-WQFN; Supplier 1: Mouser; Supplier Part Number 1: 595-LM5117PSQE/NOPB

## Sheet SH4 - 3.3V LINEAR REGULATOR.SchDoc: 3.3V Linear Regulator
size B; CheckedBy: Cindy Li; Engineer: Farris Matar; Organization: UW Robotics; Address1: 200 University Avenue; Address2: Waterloo; Address3: Ontario; Address4: Canada N2L 3G6; DocumentNumber: 4; Revision: 3; SheetNumber: 4; SheetTotal: 9
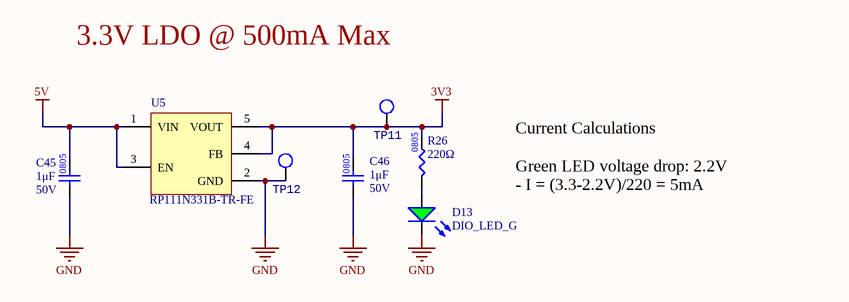
[diagram p3: SH4 - 3.3V LINEAR REGULATOR.SchDoc]

### Parts
C45  value 1μF  Voltage Rating: 50V  [CAP2012]  (hidden comment: CAP_1uF_50V_0805)
C46  value 1μF  Voltage Rating: 50V  [CAP2012]  (hidden comment: CAP_1uF_50V_0805)
D13  DIO_LED_G  [LED_0805_GREEN]
R26  value 220Ω  [RES0805]  (hidden comment: RES_220Ω_0805_5%)
TP11  TESTPOINT_LOOP  [TESTPOINT_LOOP]  (value not drawn)
TP12  TESTPOINT_LOOP  [TESTPOINT_LOOP]  (value not drawn)
U5  Manufacturer Part Number 1: RP111N331B-TR-FE  [SOT23-5]  (hidden comment: LDO_3.3V_500mA)

### Nets
3V3: C46.2 R26.2 TP11.1 U5.4(FB) U5.5(VOUT)
5V: C45.2 U5.1(VIN) U5.3(EN)
GND: C45.1 C46.1 D13.2(K) TP12.1 U5.2(GND)  [project net AGND]
NetD13_1: D13.1(A) R26.1

### Notes on the sheet
- 3.3V LDO @ 500mA Max
- Current Calculations
  Green LED voltage drop: 2.2V
  - I = (3.3-2.2V)/220 = 5mA
- Title:
- Project:
- Date:
- Rev:
- Reviewer:
- Engineer:
- Sheet:
- of

### Library data of the parts
C45 C46 = CAP_1uF_50V_0805: CAP CER 1UF 50V X7R 0805; Manufacturer 1: Samsung Electro-Mechanics; Manufacturer Part Number 1: CL21B105KBFNNNG; Supplier Part Number 1: 1276-6470-1-ND; Supplier 1: Digi-Key; LCSC Part #: C28323; Mounting Type: SMD; Package: 0805
D13 = DIO_LED_G: LED GREEN DIFFUSED 0805 SMD; Manufacturer Part Number 1: LG R971-KN-1; Manufacturer 1: OSRAM; Forward Voltage Drop: 2.2V; Package/Footprint: 0805; Supplier Part Number 1: 475-1410-1-ND; Supplier 1: Digi-Key; Mounting Type: SMD
R26 = RES_220Ω_0805_5%: RES 220 OHM 5% 1/2W 0805; Manufacturer 1: Panasonic Electronic Components; Manufacturer Part Number 1: ERJ-P06J221V; Supplier Part Number 1: P220ADCT-ND; Supplier 1: Digi-Key; LCSC Part #: C17557; Mounting Type: SMD; Package: 0805
TP11 TP12 = TESTPOINT_LOOP: as TP4 on sheet SH2 - 17V BUCK CONVERTER; Supplier 1: Digi-Key; Supplier Part Number 1: 36-5002-ND; Mounting Type: TH
U5 = LDO_3.3V_500mA: IC REG LINEAR 3.3V 500MA SOT23-5; Manufacturer 1: RICOH Electronic Devices Co., LTD.; Input Voltage (Max): 5.25V; Voltage Dropout (Max): 0.32V; Package/Footprint: SOT-25; Supplier 1: Digi-Key; Supplier Part Number 1: 2129-RP111N331B-TR-FECT-ND; Output Voltage (Fixed): 3.3V; Output Current: 500mA; Operating Temperature: -40°C - 85°C; Mounting Type: SMD

## Sheet SH5 - LOAD MONITORING 1.SchDoc: Load Monitoring 1
size B; CheckedBy: Cindy Li; Engineer: Farris Matar; Organization: UW Robotics; Address1: 200 University Avenue; Address2: Waterloo; Address3: Ontario; Address4: Canada N2L 3G6; DocumentNumber: 5; Revision: 3; SheetNumber: 5; SheetTotal: 9
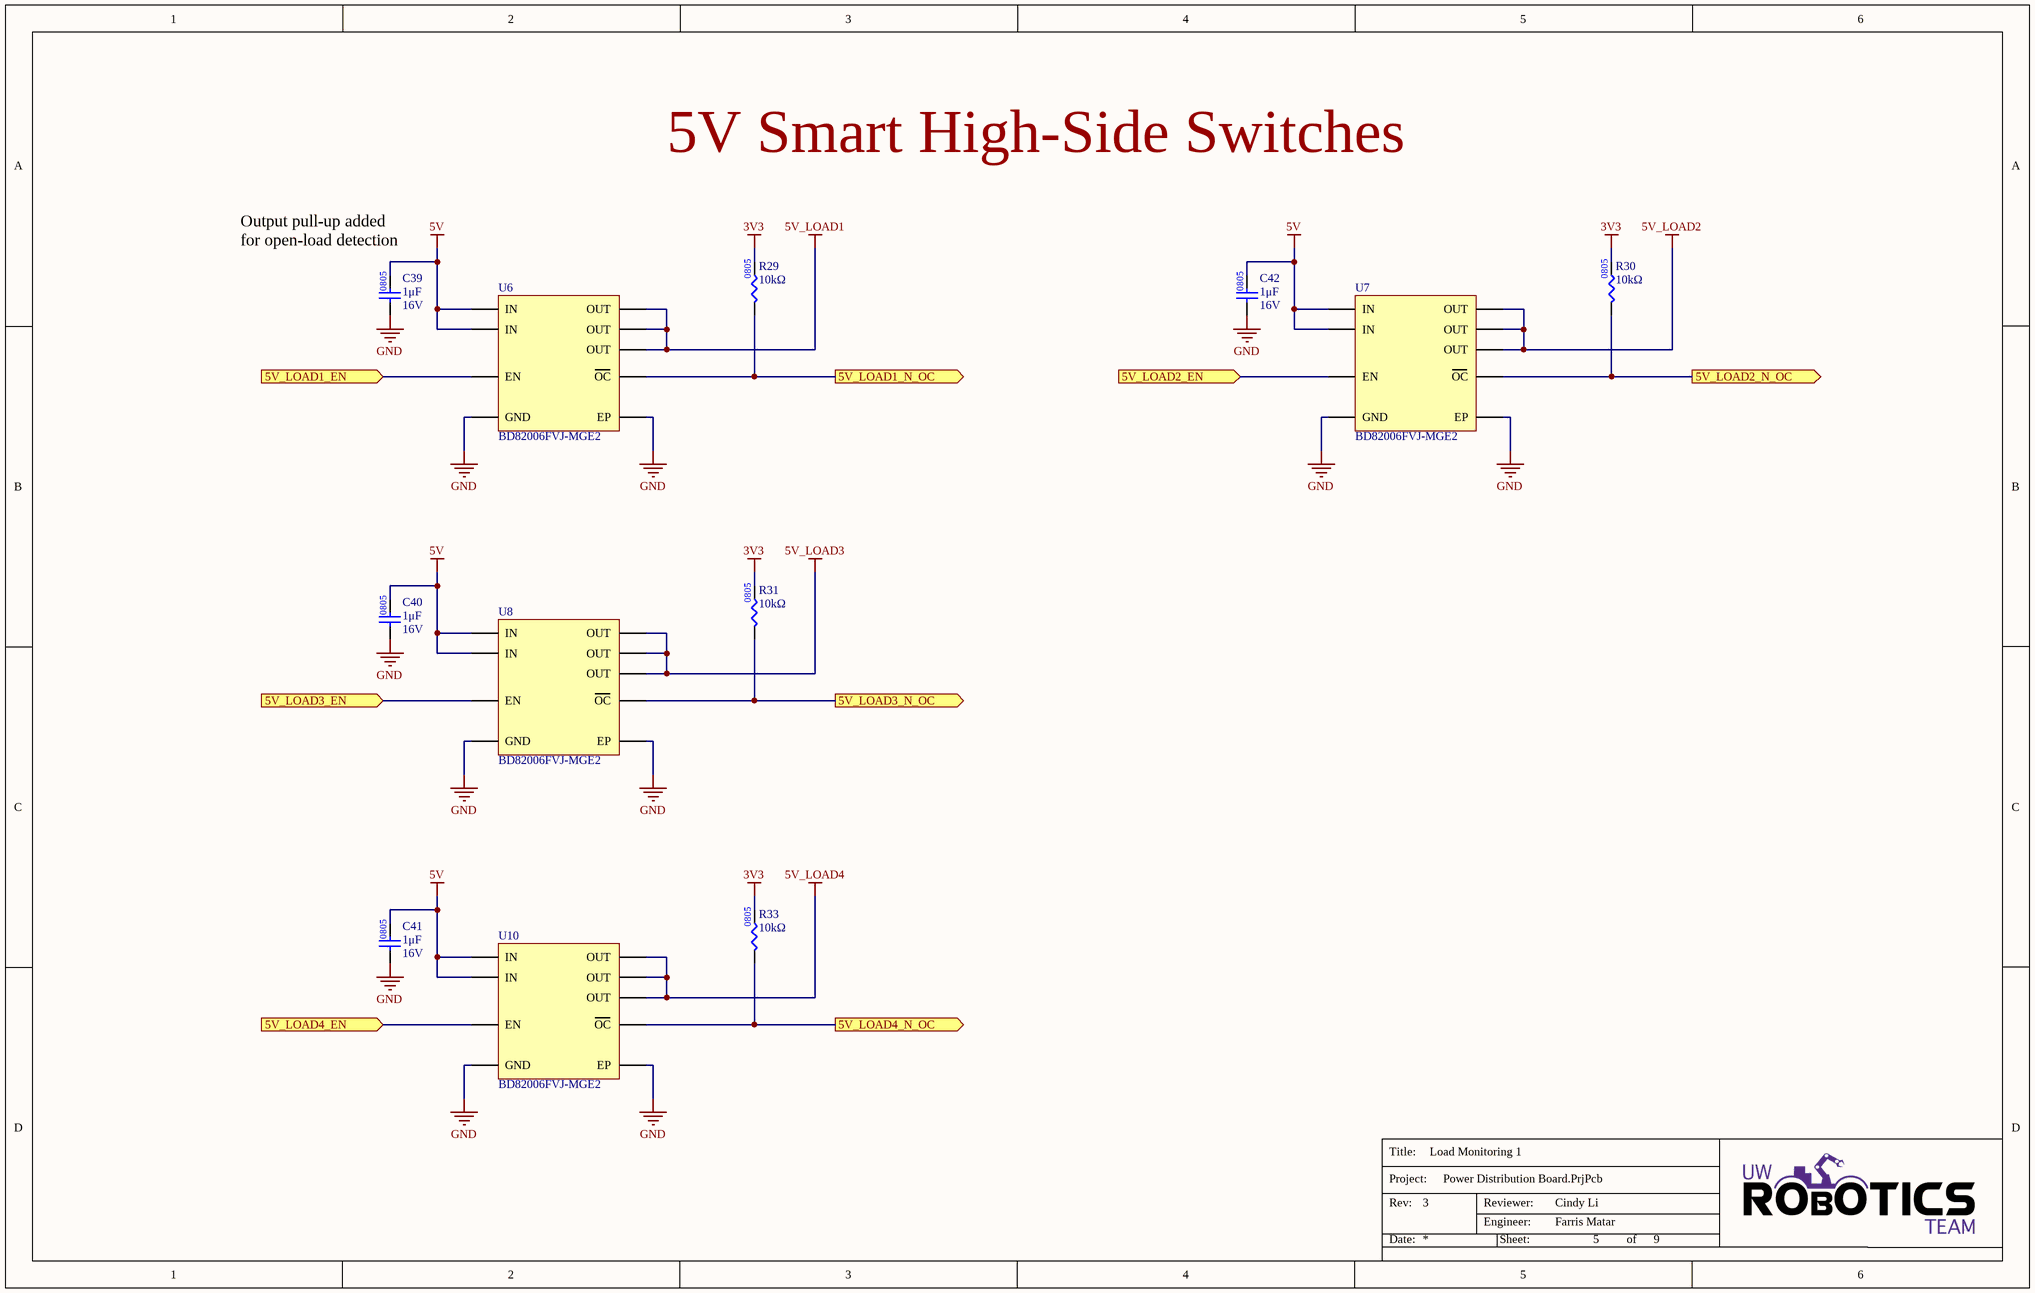
[diagram p4: SH5 - LOAD MONITORING 1.SchDoc]

### Parts
C39  value 1μF  Voltage Rating: 16V  [CAP0805]  (hidden comment: CAP_1uF_16V_0805)
C40  value 1μF  Voltage Rating: 16V  [CAP0805]  (hidden comment: CAP_1uF_16V_0805)
C41  value 1μF  Voltage Rating: 16V  [CAP0805]  (hidden comment: CAP_1uF_16V_0805)
C42  value 1μF  Voltage Rating: 16V  [CAP0805]  (hidden comment: CAP_1uF_16V_0805)
R29  value 10kΩ  [RES0805]  (hidden comment: RES_10kΩ_0805_5%)
R30  value 10kΩ  [RES0805]  (hidden comment: RES_10kΩ_0805_5%)
R31  value 10kΩ  [RES0805]  (hidden comment: RES_10kΩ_0805_5%)
R33  value 10kΩ  [RES0805]  (hidden comment: RES_10kΩ_0805_5%)
U6  BD82006FVJ-MGE2  [8-TSSOP-BJ]
U7  BD82006FVJ-MGE2  [8-TSSOP-BJ]
U8  BD82006FVJ-MGE2  [8-TSSOP-BJ]
U10  BD82006FVJ-MGE2  [8-TSSOP-BJ]

### Ports
5V_LOAD1_EN (in), 5V_LOAD1_N_OC (out), 5V_LOAD2_EN (in), 5V_LOAD2_N_OC (out), 5V_LOAD3_EN (in), 5V_LOAD3_N_OC (out), 5V_LOAD4_EN (in), 5V_LOAD4_N_OC (out)

### Nets
3V3: R29.2 R30.2 R31.2 R33.2
5V: C39.2 C40.2 C41.2 C42.2 U6.2(IN) U6.3(IN) U7.2(IN) U7.3(IN) U8.2(IN) U8.3(IN) U10.2(IN) U10.3(IN)
5V_LOAD1: U6.5(OUT) U6.6(OUT) U6.7(OUT)
5V_LOAD2: U7.5(OUT) U7.6(OUT) U7.7(OUT)
5V_LOAD3: U8.5(OUT) U8.6(OUT) U8.7(OUT)
5V_LOAD4: U10.5(OUT) U10.6(OUT) U10.7(OUT)
GND: C39.1 C40.1 C41.1 C42.1 U6.1(GND) U6.9(EP) U7.1(GND) U7.9(EP) U8.1(GND) U8.9(EP) U10.1(GND) U10.9(EP)  [project net AGND]
NetR29_1: R29.1 U6.8(OC) ; port 5V_LOAD1_N_OC
NetR30_1: R30.1 U7.8(OC) ; port 5V_LOAD2_N_OC
NetR31_1: R31.1 U8.8(OC) ; port 5V_LOAD3_N_OC
NetR33_1: R33.1 U10.8(OC) ; port 5V_LOAD4_N_OC
NetU6_4: U6.4(EN) ; port 5V_LOAD1_EN
NetU7_4: U7.4(EN) ; port 5V_LOAD2_EN
NetU8_4: U8.4(EN) ; port 5V_LOAD3_EN
NetU10_4: U10.4(EN) ; port 5V_LOAD4_EN

### Notes on the sheet
- 5V Smart High-Side Switches
- (near C39) Output pull-up added for open-load detection
- Title:
- Project:
- Date:
- Rev:
- Reviewer:
- Engineer:
- Sheet:
- of

### Library data of the parts
C39-C42 = CAP_1uF_16V_0805: CAP CER 1UF 16V X7R 0805; Manufacturer 1: Yageo; Manufacturer Part Number 1: CC0805KKX7R7BB105; Mounting Type: SMD; Supplier 1: Digi-Key; Supplier Part Number 1: 311-1365-1-ND; Package: 0805; Dielectric: X7R
R29-R31 R33 = RES_10kΩ_0805_5%: as R93 on sheet SH1 - POWER; Supplier 1: Digi-Key; Supplier Part Number 1: P10KACT-ND; LCSC Part #: C17414; Mounting Type: SMD
U6-U8 U10 = BD82006FVJ-MGE2: IC PWR SWITCH N-CHAN 1:1 8TSSOP; Manufacturer 1: Rohm Semiconductor; Package/Footprint: 8-TSSOP; Rds On (Typ): 70mOhm; Mounting Type: SMD; Supplier 1: Digi-Key; Supplier Part Number 1: BD82006FVJ-MGE2CT-ND; Manufacturer Part Number 1: BD82006FVJ-MGE2

## Sheet SH6 - LOAD MONITORING 2.SchDoc: Load Monitoring 2
size B; CheckedBy: Cindy Li; DrawnBy: Farris Matar; Engineer: Farris Matar; Organization: UW Robotics; Address1: 200 University Avenue; Address2: Waterloo; Address3: Ontario; Address4: Canada N2L 3G6; DocumentNumber: 6; Revision: 3; SheetNumber: 6; SheetTotal: 9
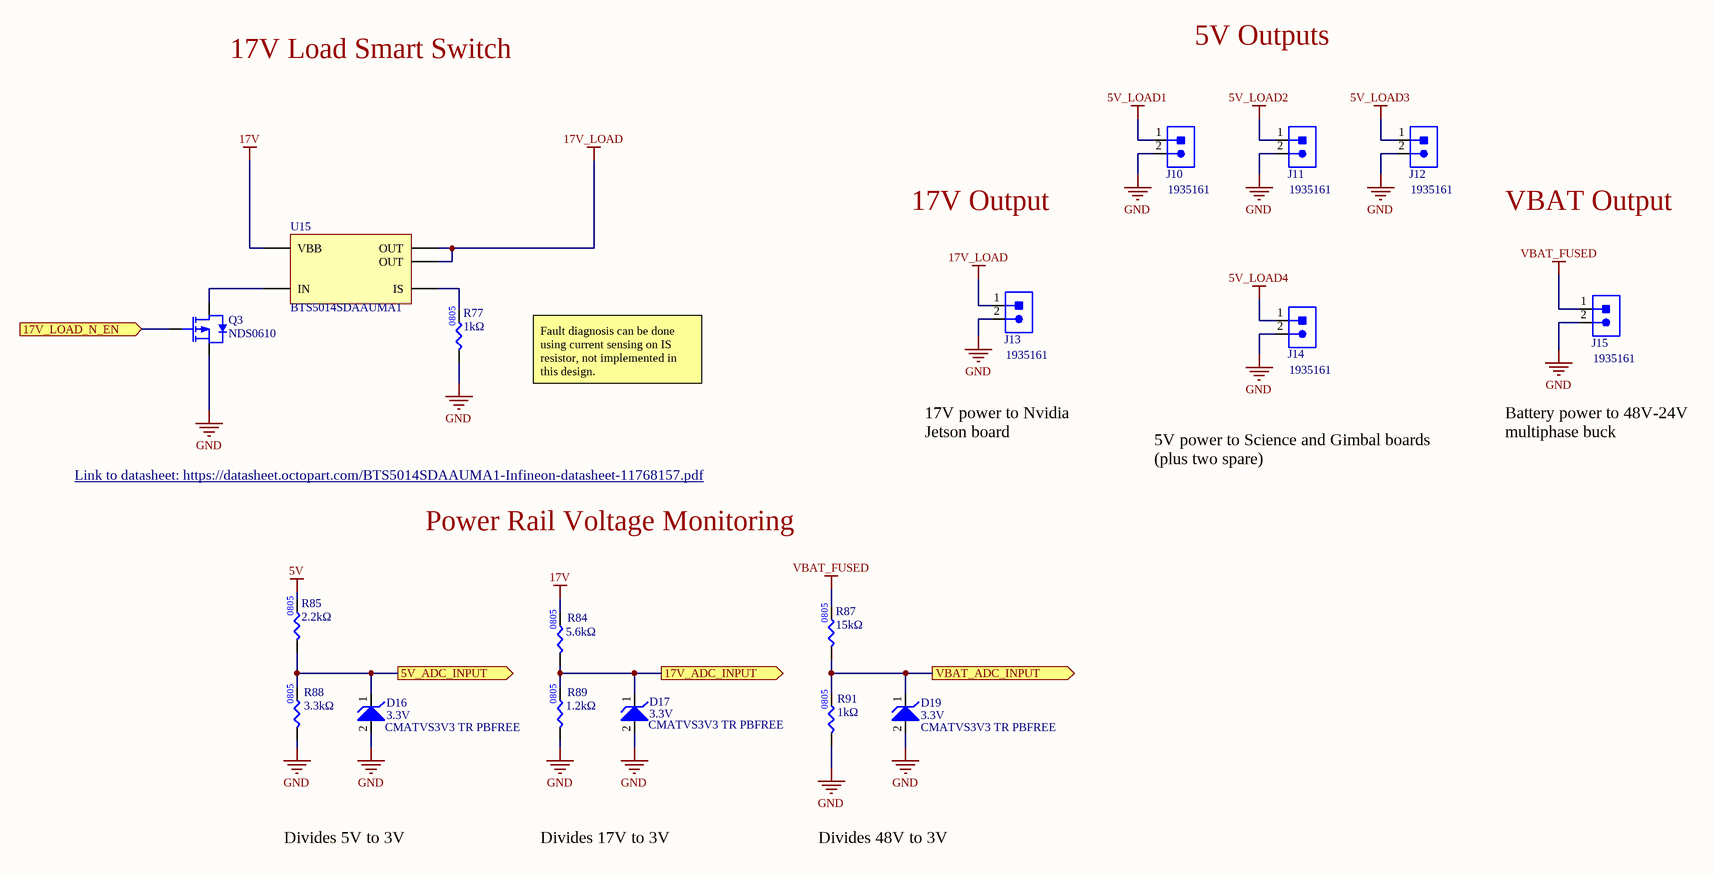
[diagram p5: SH6 - LOAD MONITORING 2.SchDoc]

### Parts
D16  Manufacturer Part Number 1: CMATVS3V3 TR PBFREE  Voltage - Reverse Standoff (Typ): 3.3V  [SOD-923]  (hidden comment: TVS_DIODE_UNIDIR_3.3V_7A)
D17  Manufacturer Part Number 1: CMATVS3V3 TR PBFREE  Voltage - Reverse Standoff (Typ): 3.3V  [SOD-923]  (hidden comment: TVS_DIODE_UNIDIR_3.3V_7A)
D19  Manufacturer Part Number 1: CMATVS3V3 TR PBFREE  Voltage - Reverse Standoff (Typ): 3.3V  [SOD-923]  (hidden comment: TVS_DIODE_UNIDIR_3.3V_7A)
J10  CON_2M_TERM  [1935161]  (value not drawn)
J11  CON_2M_TERM  [1935161]  (value not drawn)
J12  CON_2M_TERM  [1935161]  (value not drawn)
J13  CON_2M_TERM  [1935161]  (value not drawn)
J14  CON_2M_TERM  [1935161]  (value not drawn)
J15  CON_2M_TERM  [1935161]  (value not drawn)
Q3  Manufacturer Part Number 1: NDS0610  [SOT23-3]  (hidden comment: PMOS_60V_120mA)
R77  value 1kΩ  [RES0805]  (hidden comment: RES_1kΩ_0805_1%)
R84  value 5.6kΩ  [RES0805]  (hidden comment: RES_5.6kΩ_0805)
R85  value 2.2kΩ  [RES0805]  (hidden comment: RES_2.2kΩ_0805)
R87  value 15kΩ  [RES0805]  (hidden comment: RES_15kΩ_0805_1%)
R88  value 3.3kΩ  [RES0805]  (hidden comment: RES_3.3kΩ_0805_1%)
R89  value 1.2kΩ  [RES0805]  (hidden comment: RES_1.2kΩ_0805)
R91  value 1kΩ  [RES0805]  (hidden comment: RES_1kΩ_0805_1%_1)
U15  BTS5014SDAAUMA1  [D2PAK-4]

### Ports
5V_ADC_INPUT (out), 17V_ADC_INPUT (out), 17V_LOAD_N_EN (in), VBAT_ADC_INPUT (out)

### Nets
5V: R85.2
5V_LOAD1: J10.1
5V_LOAD2: J11.1
5V_LOAD3: J12.1
5V_LOAD4: J14.1
17V: R84.2 U15.3(VBB)
17V_LOAD: J13.1 U15.1(OUT) U15.5(OUT)
GND: D16.2 D17.2 D19.2 J10.2 J11.2 J12.2 J13.2 J14.2 J15.2 Q3.2(Source) R77.1 R88.1 R89.1 R91.1  [project net AGND]
VBAT_FUSED: J15.1 R87.2
NetD16_1: D16.1 R85.1 R88.2 ; port 5V_ADC_INPUT
NetD17_1: D17.1 R84.1 R89.2 ; port 17V_ADC_INPUT
NetD19_1: D19.1 R87.1 R91.2 ; port VBAT_ADC_INPUT
NetQ3_1: Q3.1(Gate) ; port 17V_LOAD_N_EN
NetQ3_3: Q3.3(Drain) U15.2(IN)
NetR77_2: R77.2 U15.4(IS)

### Notes on the sheet
- 5V Outputs
- 17V Load Smart Switch
- 17V Output
- VBAT Output
- Fault diagnosis can be done using current sensing on IS resistor, not implemented in this design.
- 17V power to Nvidia Jetson board
- Battery power to 48V-24V multiphase buck
- Link to datasheet: https://datasheet.octopart.com/BTS5014SDAAUMA1-Infineon-datasheet-11768157.pdf <https://datasheet.octopart.com/BTS5014SDAAUMA1-Infineon-datasheet-11768157.pdf>
- 5V power to Science and Gimbal boards (plus two spare)
- Power Rail Voltage Monitoring
- Divides 5V to 3V
- Divides 17V to 3V
- Divides 48V to 3V
- Title:
- Project:
- Date:
- Rev:
- Reviewer:
- Engineer:
- Sheet:
- of
- (in symbol RES_15kΩ_0805_1%) 0805

### Library data of the parts
D16 D17 D19 = TVS_DIODE_UNIDIR_3.3V_7A: TVS DIODE 3.3VWM 11VC SOD923; Manufacturer 1: Central Semiconductor Corp; Voltage - Breakdown (Min): 5V; Voltage - Clamping (Max) @ Ipp: 11V; Supplier 1: Digi-Key; Supplier Part Number 1: 1514-CMATVS3V3TRPBFREECT-ND; Mounting Type: SMD; Package/Footprint: SOD-923
J10-J15 = CON_2M_TERM: TERM BLK 2POS SIDE ENTRY 5MM; Manufacturer 1: Phoenix Contact; Max Current Rating: 16A; Current: 18A; Voltage: 300V; Package/Footprint: SMD; Supplier 1: Digi-Key; Supplier Part Number 1: 277-1667-ND; Manufacturer Part Number 1: 1935161; Mounting Type: TH
Q3 = PMOS_60V_120mA: MOSFET P-CH 60V 120MA SOT-23; Manufacturer 1: ON Semiconductor; Vgs (Max): ±20V; Vdss: 60V; Package/Footprint: SOT-23; Mounting Type: SMD; Id: 120mA; Supplier 1: Digi-Key; Supplier Part Number 1: NDS0610CT-ND
R77 = RES_1kΩ_0805_1%: as R1 on sheet SH1 - POWER; Supplier 1: Digi-Key; Mounting Type: SMD; Supplier Part Number 1: 311-1.00KCRCT-ND; LCSC Part #: C17513; Package: 0805
R84 = RES_5.6kΩ_0805_5%: RES 5.6K OHM 5% 1/8W 0805; Manufacturer 1: Yageo; Manufacturer Part Number 1: RC0805JR-075K6L; Supplier Part Number 1: 311-5.6KARCT-ND; Supplier 1: Digi-Key; Tolerance: 5%; Package: 0805
R85 = RES_2.2kΩ_0805_5%: RES 2.2K OHM 5% 1/8W 0805; Manufacturer 1: Vishay Dale; Manufacturer Part Number 1: CRCW08052K20JNEAC; Supplier Part Number 1: 541-4169-1-ND; Supplier 1: Digi-Key; Tolerance: 5%; Package: 0805
R87 = RES_15kΩ_0805_1%: RES 15K OHM 1% 1/8W 0805 /; Manufacturer 1: Vishay Dale; Manufacturer Part Number 1: CRCW080515K0FKEA; Supplier Part Number 1: 541-15.0KCCT-ND; Supplier 1: Digi-Key
R88 = RES_3.3kΩ_0805_1%: as R16 on sheet SH2 - 17V BUCK CONVERTER; Supplier 1: Digi-Key; Supplier Part Number 1: 541-3.30KHCT-ND; LCSC Part #: C26010; Mounting Type: SMD; Package: 0805
R89 = RES_1.2kΩ_0805_5%: RES 1.2K OHM 5% 1/8W 0805; Manufacturer 1: Yageo; Manufacturer Part Number 1: RC0805JR-071K2L; Supplier 1: Digi-Key; Supplier Part Number 1: 311-1.2KARCT-ND; Tolerance: 5%; Package: 0805
R91 = RES_1kΩ_0805_1%_1: as R21 on sheet SH2 - 17V BUCK CONVERTER; Supplier 1: Digi-Key; Supplier Part Number 1: 311-1.00KCRCT-ND; Package: 0805; Mounting Type: SMD; LCSC Part #: C17513
U15 = BTS5014SDAAUMA1: IC PWR SWITCH N-CHAN 1:1 TO252-5; Manufacturer 1: Infineon Technologies; Package/Footprint: TO-252-5; Mounting Type: SMD; Supplier 1: Digi-Key; Supplier Part Number 1: BTS5014SDAAUMA1CT-ND; Manufacturer Part Number 1: BTS5014SDAAUMA1

## Sheet SH7 - MICROCONTROLLER.SchDoc: Microcontroller
size B; CheckedBy: Cindy Li; Engineer: Farris Matar; Organization: UW Robotics; Address1: 200 University Avenue; Address2: Waterloo; Address3: Ontario; Address4: Canada N2L 3G6; DocumentNumber: 7; Revision: 3; SheetNumber: 7; SheetTotal: 9
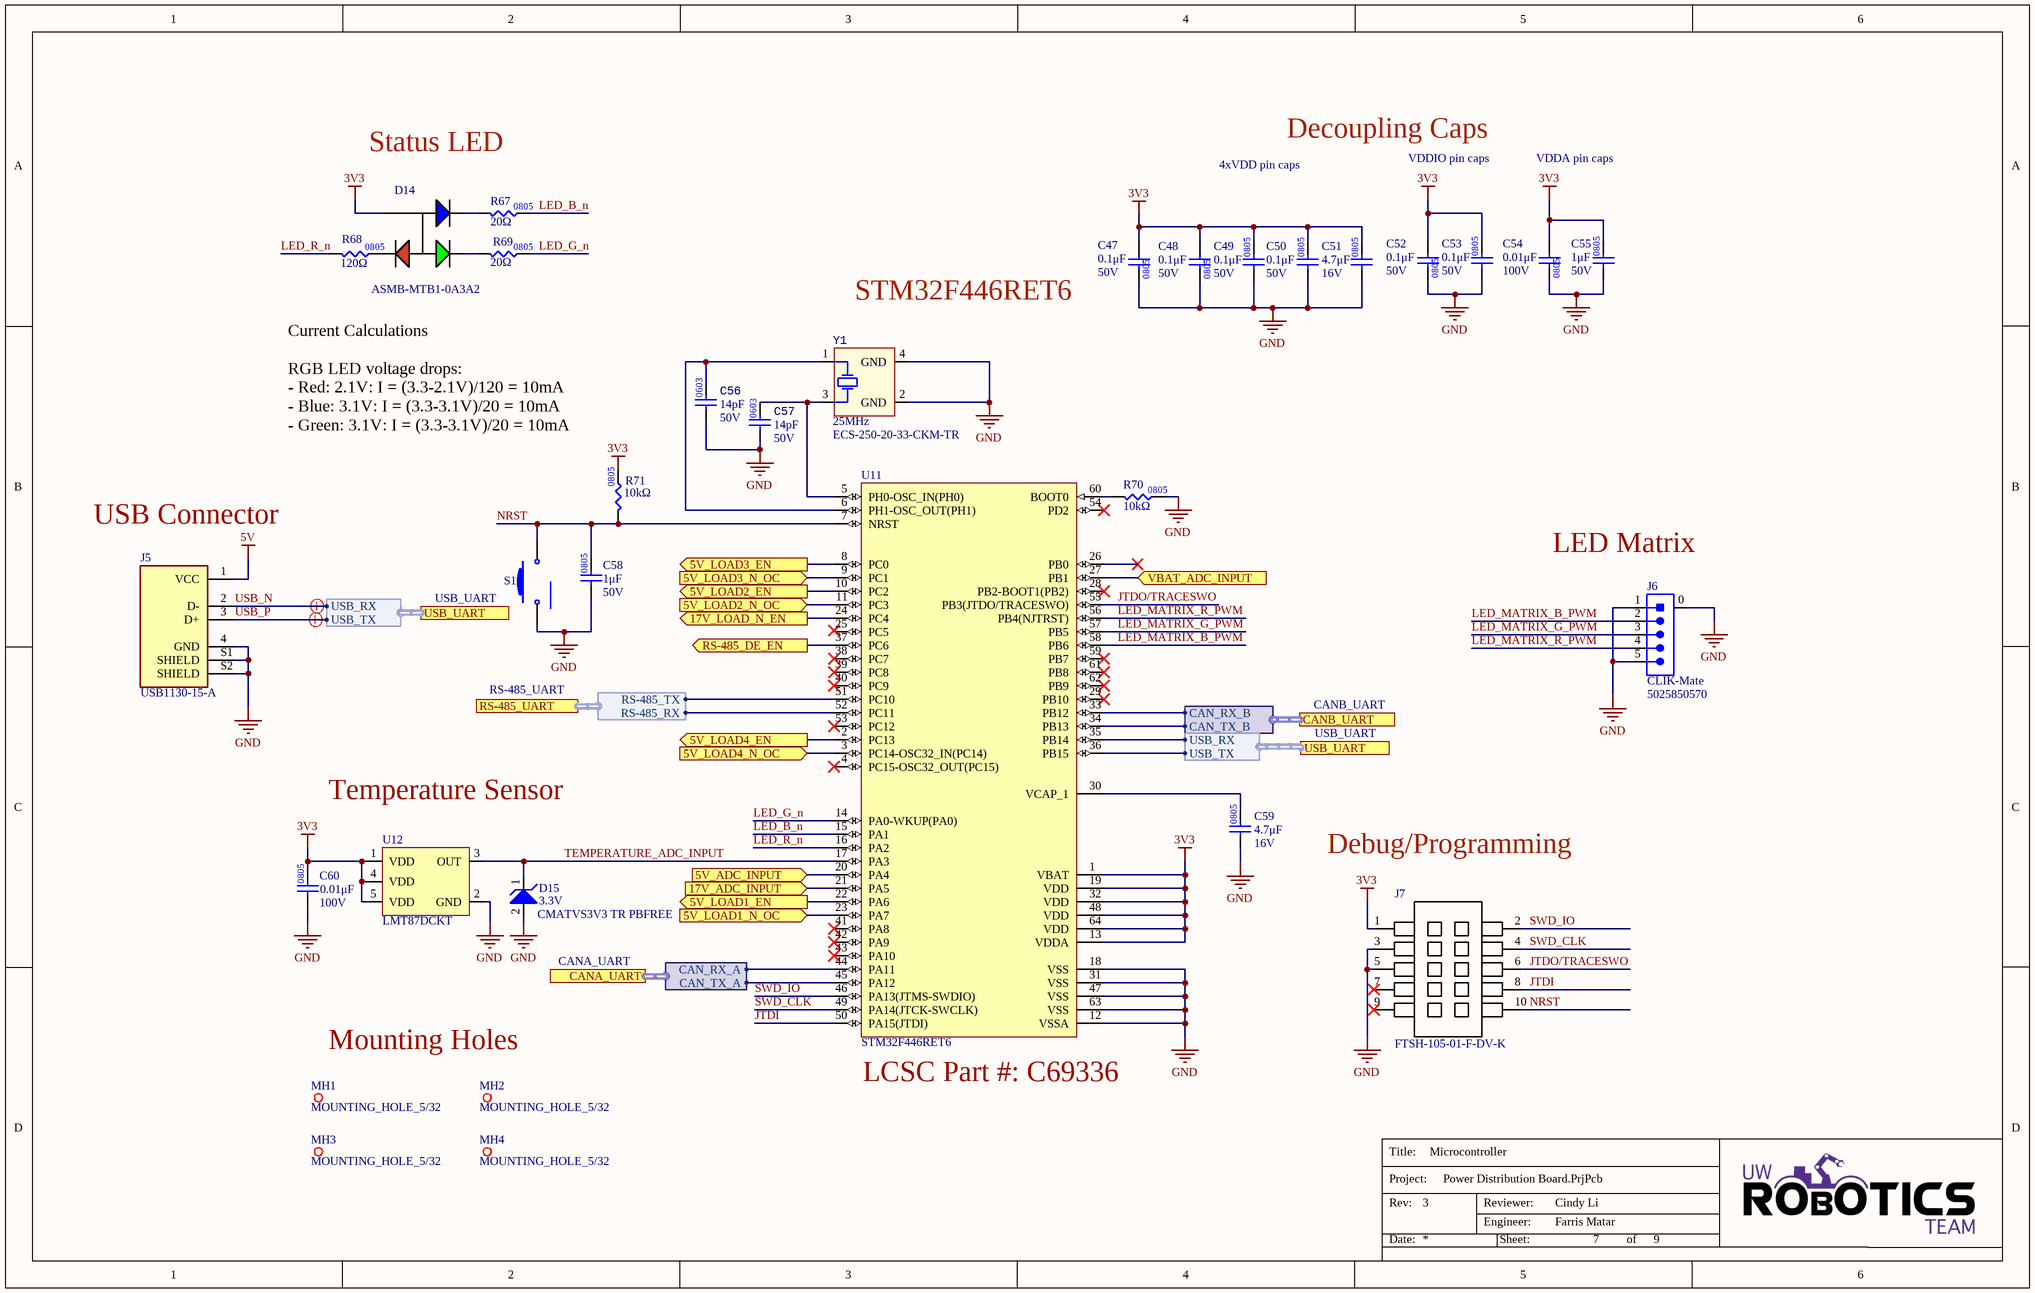
[diagram p6: SH7 - MICROCONTROLLER.SchDoc]

### Parts
C47  value 0.1μF  Voltage Rating: 50V  [CAP2012]  (hidden comment: CAP_0.1uF_50V_0805)
C48  value 0.1μF  Voltage Rating: 50V  [CAP2012]  (hidden comment: CAP_0.1uF_50V_0805)
C49  value 0.1μF  Voltage Rating: 50V  [CAP2012]  (hidden comment: CAP_0.1uF_50V_0805)
C50  value 0.1μF  Voltage Rating: 50V  [CAP2012]  (hidden comment: CAP_0.1uF_50V_0805)
C51  value 4.7μF  Voltage Rating: 16V  [CAP0805]  (hidden comment: CAP_4.7uF_16V_0805)
C52  value 0.1μF  Voltage Rating: 50V  [CAP2012]  (hidden comment: CAP_0.1uF_50V_0805)
C53  value 0.1μF  Voltage Rating: 50V  [CAP2012]  (hidden comment: CAP_0.1uF_50V_0805)
C54  value 0.01μF  Voltage Rating: 100V  [CAP0805]  (hidden comment: CAP_0.01uF_100V_0805)
C55  value 1μF  Voltage Rating: 50V  [CAP2012]  (hidden comment: CAP_1uF_50V_0805)
C56  value 14pF  Voltage Rating: 50V  [CAP0603]  (hidden comment: CAP_14pF_50V_0603)
C57  value 14pF  Voltage Rating: 50V  [CAP0603]  (hidden comment: CAP_14pF_50V_0603)
C58  value 1μF  Voltage Rating: 50V  [CAP2012]  (hidden comment: CAP_1uF_50V_0805)
C59  value 4.7μF  Voltage Rating: 16V  [CAP0805]  (hidden comment: CAP_4.7uF_16V_0805)
C60  value 0.01μF  Voltage Rating: 100V  [CAP0805]  (hidden comment: CAP_0.01uF_100V_0805)
D14  Manufacturer Part Number 1: ASMB-MTB1-0A3A2  [LED_RGB]  (hidden comment: LED_RGB)
D15  Manufacturer Part Number 1: CMATVS3V3 TR PBFREE  Voltage - Reverse Standoff (Typ): 3.3V  [SOD-923]  (hidden comment: TVS_DIODE_UNIDIR_3.3V_7A)
J5  Manufacturer Part Number 1: USB1130-15-A  [USB-A 2.0 Connector]  (hidden comment: USB-A 2.0 Connector)
J6  Family: CLIK-Mate  Manufacturer Part Number 1: 5025850570  [MOLEX-5025850570]  (hidden comment: CON_5M_SM_RA)
J7  Manufacturer Part Number 1: FTSH-105-01-F-DV-K  [FTSH-105-01-F-DV-K-P-TR]  (hidden comment: CON_PROGRAMMING)
MH1  MOUNTING_HOLE_5/32  [MOUNTING_HOLE_5/38]  (no BOM)
MH2  MOUNTING_HOLE_5/32  [MOUNTING_HOLE_5/38]  (no BOM)
MH3  MOUNTING_HOLE_5/32  [MOUNTING_HOLE_5/38]  (no BOM)
MH4  MOUNTING_HOLE_5/32  [MOUNTING_HOLE_5/38]  (no BOM)
R67  value 20Ω  [RES0805]  (hidden comment: RES_20Ω_0805_1%)
R68  value 120Ω  [RES0805]  (hidden comment: RES_120Ω_0805_1%)
R69  value 20Ω  [RES0805]  (hidden comment: RES_20Ω_0805_1%)
R70  value 10kΩ  [RES0805]  (hidden comment: RES_10kΩ_0805_5%)
R71  value 10kΩ  [RES0805]  (hidden comment: RES_10kΩ_0805_5%)
S1  SW_PUSHBUTTON  [TACTILE_SWITCH_SMD]  (value not drawn)
U11  STM32F446RET6  [STM-LQFP64_L]
U12  Manufacturer Part Number 1: LMT87DCKT  [SOT65P210X110-5N]  (hidden comment: IC_TEMP_SENSOR_2)
Y1  Frequency: 25MHz  Manufacturer Part Number 1: ECS-250-20-33-CKM-TR  [XTAL_ECS-250-20-33-CKM-TR]  (hidden comment: CRYSTAL_25MHZ_20PF)

### Ports
5V_ADC_INPUT (in), 5V_LOAD1_EN (out), 5V_LOAD1_N_OC (in), 5V_LOAD2_EN (out), 5V_LOAD2_N_OC (in), 5V_LOAD3_EN (out), 5V_LOAD3_N_OC (in), 5V_LOAD4_EN (out), 5V_LOAD4_N_OC (in), 17V_ADC_INPUT (in), 17V_LOAD_N_EN (out), CANA_UART (harness CANA_UART), CANB_UART (harness CANB_UART), RS-485_DE_EN (out), RS-485_UART (harness RS-485_UART), USB_UART (harness USB_UART), VBAT_ADC_INPUT (in)

### Harnesses
CANA_UART: CAN_RX_A, CAN_TX_A
CANB_UART: CAN_RX_B, CAN_TX_B
RS-485_UART: RS-485_TX, RS-485_RX
USB_UART: USB_TX, USB_RX

### Nets
3V3: C47.2 C48.2 C49.2 C50.2 C51.2 C52.2 C53.2 C54.2 C55.2 C60.2 D14.4(COMMON_ANODE) J7.1 R71.2 U11.1(VBAT) U11.13(VDDA) U11.19(VDD) U11.32(VDD) U11.48(VDD) U11.64(VDD) U12.1(VDD) U12.4(VDD) U12.5(VDD)
5V: J5.1(VCC)
GND: C47.1 C48.1 C49.1 C50.1 C51.1 C52.1 C53.1 C54.1 C55.1 C56.1 C57.1 C58.1 C59.1 C60.1 D15.2 J5.4(GND) J5.S1(SHIELD) J5.S2(SHIELD) J6.0 J6.1 J6.5 J7.3 J7.5 R70.2 S1.1 U11.12(VSSA) U11.18(VSS) U11.31(VSS) U11.47(VSS) U11.63(VSS) U12.2(GND) Y1.2(GND) Y1.4(GND)  [project net AGND]
JTDI: J7.8 U11.50(PA15(JTDI))
JTDO/TRACESWO: J7.6 U11.55(PB3(JTDO/TRACESWO))
LED_B_n: R67.2 U11.15(PA1)
LED_G_n: R69.2 U11.14(PA0-WKUP(PA0))
LED_MATRIX_B_PWM: J6.2 U11.58(PB6)
LED_MATRIX_G_PWM: J6.3 U11.57(PB5)
LED_MATRIX_R_PWM: J6.4 U11.56(PB4(NJTRST))
LED_R_n: R68.1 U11.16(PA2)
NRST: C58.2 J7.10 R71.1 S1.2 U11.7(NRST)
SWD_CLK: J7.4 U11.49(PA14(JTCK-SWCLK))
SWD_IO: J7.2 U11.46(PA13(JTMS-SWDIO))
TEMPERATURE_ADC_INPUT: D15.1 U11.17(PA3) U12.3(OUT)
USB_N: J5.2(D-) U11.35(PB14) ; port USB_UART.USB_RX
USB_P: J5.3(D+) U11.36(PB15) ; port USB_UART.USB_TX
NetC56_2: C56.2 U11.6(PH1-OSC_OUT(PH1)) Y1.1(HOT)
NetC57_2: C57.2 U11.5(PH0-OSC_IN(PH0)) Y1.3(HOT)
NetC59_2: C59.2 U11.30(VCAP_1)
NetD14_1: D14.1(CATHODE_(RED)) R68.2
NetD14_2: D14.2(CATHODE_(GREEN)) R69.1
NetD14_3: D14.3(CATHODE_(BLUE)) R67.1
NetD16_1: U11.20(PA4) ; port 5V_ADC_INPUT
NetD17_1: U11.21(PA5) ; port 17V_ADC_INPUT
NetD19_1: U11.27(PB1) ; port VBAT_ADC_INPUT
NetQ3_1: U11.24(PC4) ; port 17V_LOAD_N_EN
NetR29_1: U11.23(PA7) ; port 5V_LOAD1_N_OC
NetR30_1: U11.11(PC3) ; port 5V_LOAD2_N_OC
NetR31_1: U11.9(PC1) ; port 5V_LOAD3_N_OC
NetR33_1: U11.3(PC14-OSC32_IN(PC14)) ; port 5V_LOAD4_N_OC
NetR70_1: R70.1 U11.60(BOOT0)
NetTP13_1: U11.52(PC11) ; port RS-485_UART.RS-485_RX
NetTP14_1: U11.51(PC10) ; port RS-485_UART.RS-485_TX
NetU6_4: U11.22(PA6) ; port 5V_LOAD1_EN
NetU7_4: U11.10(PC2) ; port 5V_LOAD2_EN
NetU8_4: U11.8(PC0) ; port 5V_LOAD3_EN
NetU10_4: U11.2(PC13) ; port 5V_LOAD4_EN
NetU11_33: U11.33(PB12) ; port CANB_UART.CAN_RX_B
NetU11_34: U11.34(PB13) ; port CANB_UART.CAN_TX_B
NetU11_37: U11.37(PC6) ; port RS-485_DE_EN
NetU11_44: U11.44(PA11) ; port CANA_UART.CAN_RX_A
NetU11_45: U11.45(PA12) ; port CANA_UART.CAN_TX_A

Not connected (* = marked no-connect by the designer): J7 7* 9*; U11 4(PC15-OSC32_OUT(PC15))* 25(PC5) 26(PB0)* 28(PB2-BOOT1(PB2))* 29(PB10)* 38(PC7)* 39(PC8)* 40(PC9)* 41(PA8)* 42(PA9)* 43(PA10)* 53(PC12)* 54(PD2)* 59(PB7)* 61(PB8)* 62(PB9)*

### Layout directives
differential pair: USB_N, USB_P

### Notes on the sheet
- Status LED
- 4xVDD pin caps
- Decoupling Caps
- VDDIO pin caps
- VDDA pin caps
- STM32F446RET6
- Current Calculations
  RGB LED voltage drops:
  - Red: 2.1V: I = (3.3-2.1V)/120 = 10mA
  - Blue: 3.1V: I = (3.3-3.1V)/20 = 10mA
  - Green: 3.1V: I = (3.3-3.1V)/20 = 10mA
- (near J5) USB Connector
- (near J6) LED Matrix
- Temperature Sensor
- Debug/Programming
- Mounting Holes
- (near U11) LCSC Part #: C69336
- Title:
- Project:
- Date:
- Rev:
- Reviewer:
- Engineer:
- Sheet:
- of

### Library data of the parts
C47-C50 C52 C53 = CAP_0.1uF_50V_0805: as C35 on sheet SH2 - 17V BUCK CONVERTER; Supplier Part Number 1: 490-8049-1-ND; Supplier 1: Digi-Key; Dielectric: X7R; LCSC Part #: C49678; Mounting Type: SMD
C51 C59 = CAP_4.7uF_16V_0805: CAP CER 4.7UF 16V X5R 0805; Manufacturer Part Number 1: CL21A475KOFNNNE; Manufacturer 1: Samsung Electro-Mechanics; Supplier Part Number 1: 1276-1065-1-ND; Supplier 1: Digi-Key; Dielectric: X5R; LCSC Part #: C1779; Mounting Type: SMD; Package: 0805
C54 C60 = CAP_0.01uF_100V_0805: CAP CER 0.01uF 100V X7R 0805; Manufacturer Part Number 1: 08051C103KAT2A; Manufacturer 1: AVX Corporation; Supplier Part Number 1: 478-1358-1-ND; Supplier 1: Digi-Key; Dielectric: X7R; LCSC Part #: C1710; Mounting Type: SMD; Package: 0805
C55 C58 = CAP_1uF_50V_0805: as C45 on sheet SH4 - 3.3V LINEAR REGULATOR; Supplier Part Number 1: 1276-6470-1-ND; Supplier 1: Digi-Key; LCSC Part #: C28323; Mounting Type: SMD; Package: 0805
C56 C57 = CAP_14pF_50V_0603: CAP CER 14PF 50V C0G/NP0 0603; Manufacturer 1: Samsung; Manufacturer Part Number 1: CL10C140JB8NNNC; Dielectric: C0G; Supplier 1: Digi-Key; Supplier Part Number 1: 1276-2187-1-ND; Mounting Type: SMD; Package: 0603
D14 = LED_RGB: LED RGB DIFFUSED 4PLCC SMD; Manufacturer 1: Broadcom; Color: Blue,Green,Red; Lens Color: White; Viewing Angle: 115°; Lens Style: Round; Luminous Intensity: 350mcd; Dominant Wavelength: 470nm; Forward Voltage: 3.1V; Test Current: 20mA; Package/Footprint: 4-PLCC; Supplier 1: Digi-Key; Number of Pins: 4; Lens Transparency: Diffused; Supplier Part Number 1: 516-3280-1-ND; Mounting Type: SMD
D15 = TVS_DIODE_UNIDIR_3.3V_7A: as D16 on sheet SH6 - LOAD MONITORING 2; Supplier 1: Digi-Key; Supplier Part Number 1: 1514-CMATVS3V3TRPBFREECT-ND; Mounting Type: SMD; Package/Footprint: SOD-923
J5 = USB-A 2.0 Connector: USB-A (USB TYPE-A) USB 2.0 Receptacle Connector 4 Position Through Hole, Right Angle; Manufacturer 1: GCT; Supplier 1: Digi-Key; Supplier Part Number 1: 2073-USB1130-15-ACT-ND
J6 = CON_5M_SM_RA: CONN HEADER SMD RIGHT ANGLE 1.5MM PITCH; Manufacturer 1: Molex; Current Rating: 2A; Supplier 1: Digi-Key; Supplier Part Number 1: WM14469CT-ND; Orientation: Right Angle; Mounting Type: SMD; Package/Footprint: SMD
J7 = CON_PROGRAMMING: CONN HEADER SMD 10POS 1.27MM; Manufacturer 1: Samtec; Supplier 1: Digi-Key; Pitch: 1.27mm; Supplier Part Number 1: SAM8796-ND; Mounting Type: SMD
R67 R69 = RES_20Ω_0805_1%: RES 20 OHM 1% 1/8W 0805; Manufacturer 1: Yageo; Manufacturer Part Number 1: RC0805FR-0720RL; Supplier Part Number 1: 311-20.0CRCT-ND; Supplier 1: Digi-Key; LCSC Part #: C17581; Mounting Type: SMD; Package: 0805
R68 = RES_120Ω_0805_1%: RES 120 OHM 1% 1/8W 0805; Manufacturer 1: Vishay; Manufacturer Part Number 1: CRCW0805120RFKEA; Package/Footprint: 0805; Supplier Part Number 1: 541-120CCT-ND; Supplier 1: Digi-Key; LCSC Part #: C17437; Mounting Type: SMD
R70 R71 = RES_10kΩ_0805_5%: as R93 on sheet SH1 - POWER; Supplier Part Number 1: P10KACT-ND; Supplier 1: Digi-Key; LCSC Part #: C17414; Mounting Type: SMD
S1 = SW_PUSHBUTTON: SMT 3.0 X 2.6 MM TACT SWITCH WIT; Manufacturer Part Number 1: 435151014824; Manufacturer 1: Würth Elektronik; Supplier 1: Digi-Key; Supplier Part Number 1: 732-435151014824CT-ND
U11 = MCU_STM32F446RET6: ARM Cortex-M4 32-bit MCU+FPU, 512 KB Flash, 128 KB Internal RAM, 50 I/Os, 64-Pin LQFP, -40 to 85 degC, Tray; I/Os (High Current): 50; Supply Voltage(Vcc) min (V): 1.7; Operating Frequency(F) (Processor speed) (MHz): 180; D/A Converter: 2; Internal RAM Size (kB): 128; FLASH Size (Prog) (kB): 512; Core: ARM Cortex-M4; ComponentLink1Description: Manufacturer URL; Package Reference: 64-Pin Low-profile Quad Flat Package, Body 10 x 10 mm, Pitch 0.5 mm; ComponentLink2URL: http://www.st.com/st-web-ui/static/active/en/resource/technical/document/datasheet/DM00141306.pdf; Packing: Tray; DatasheetVersion: Rev. 6; ComponentLink1URL: http://www.st.com/; ComponentLink2Description: Datasheet; Package Description: LQFP64; Mounting Technology: Surface Mount; Supplier Part Number 1: 497-15376-ND; Supplier 1: Digi-Key
U12 = IC_TEMP_SENSOR_2: SENSOR ANALOG -50C-150C SC70-5; Manufacturer 1: Texas Instruments; Supplier Part Number 1: 296-35730-1-ND; Supplier 1: Digi-Key; Mounting Type: SMD; Package/Footprint: SC70-5
Y1 = CRYSTAL_25MHZ_20PF: CRYSTAL 25.0000MHZ 20PF SMD; Manufacturer 1: ECS Inc.; Load Capacitance: 20pF; Supplier 1: Digi-Key; Supplier Part Number 1: XC1817CT-ND; Mounting Type: SMD; Package/Footprint: SMD

## Sheet SH8 - CAN.SchDoc: CAN
size B; CheckedBy: Cindy Li; Engineer: Farris Matar; Organization: UW Robotics; Address1: 200 University Avenue; Address2: Waterloo; Address3: Ontario; Address4: Canada N2L 3G6; DocumentNumber: 8; Revision: 3; SheetNumber: 8; SheetTotal: 9
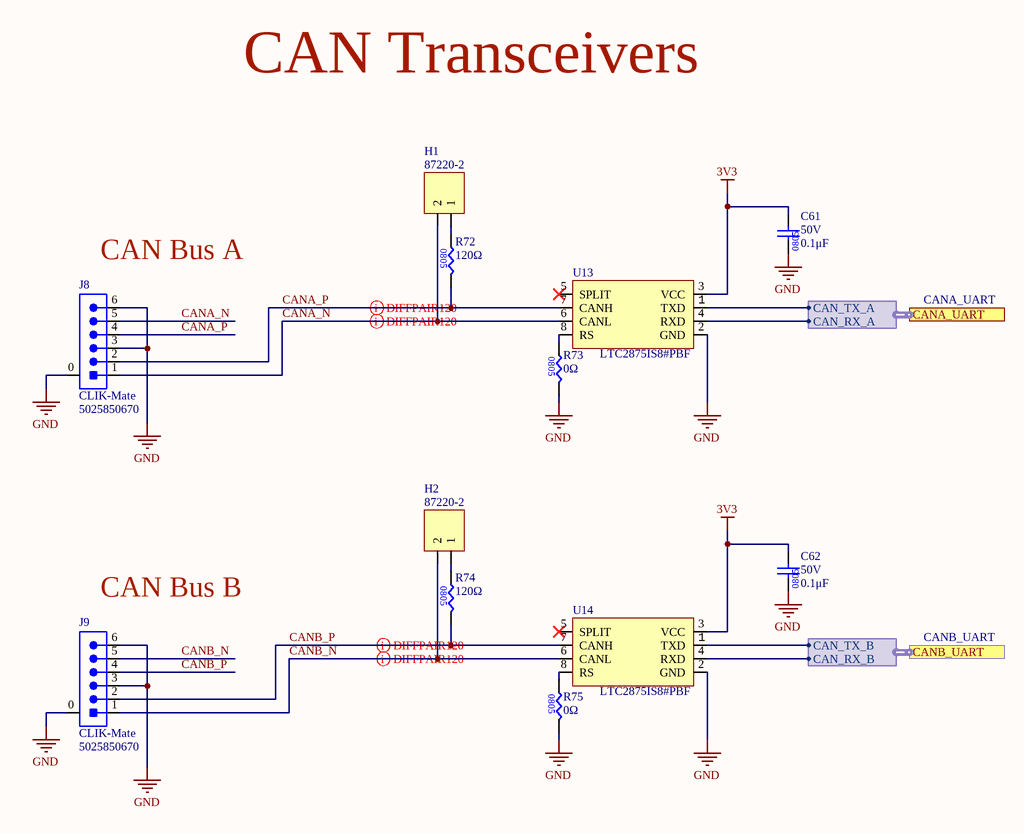
[diagram p7: SH8 - CAN.SchDoc]

### Parts
C61  value 0.1μF  Voltage Rating: 50V  [CAP2012]  (hidden comment: CAP_0.1uF_50V_0805)
C62  value 0.1μF  Voltage Rating: 50V  [CAP2012]  (hidden comment: CAP_0.1uF_50V_0805)
H1  Manufacturer Part Number 1: 87220-2  [HDR1X2]  (hidden comment: JUMPER_2)
H2  Manufacturer Part Number 1: 87220-2  [HDR1X2]  (hidden comment: JUMPER_2)
J8  Family: CLIK-Mate  Manufacturer Part Number 1: 5025850670  [MOLEX-5025850670]  (hidden comment: CON_6M_SM_RA_1.5mm)
J9  Family: CLIK-Mate  Manufacturer Part Number 1: 5025850670  [MOLEX-5025850670]  (hidden comment: CON_6M_SM_RA_1.5mm)
R72  value 120Ω  [RES0805]  (hidden comment: RES_120Ω_0805_1%)
R73  value 0Ω  [RES0805]  (hidden comment: RES_0Ω_0805)
R74  value 120Ω  [RES0805]  (hidden comment: RES_120Ω_0805_1%)
R75  value 0Ω  [RES0805]  (hidden comment: RES_0Ω_0805)
U13  Manufacturer Part Number 1: LTC2875IS8#PBF  [LT-S8_N]  (hidden comment: LTC2875)
U14  Manufacturer Part Number 1: LTC2875IS8#PBF  [LT-S8_N]  (hidden comment: LTC2875)

### Ports
CANA_UART (harness CANA_UART), CANB_UART (harness CANB_UART)

### Harnesses
CANA_UART: CAN_RX_A, CAN_TX_A
CANB_UART: CAN_RX_B, CAN_TX_B

### Nets
3V3: C61.2 C62.2 U13.3(VCC) U14.3(VCC)
GND: C61.1 C62.1 J8.0 J8.3 J8.6 J9.0 J9.3 J9.6 R73.2 R75.2 U13.2(GND) U14.2(GND)  [project net AGND]
CANA_N: H1.2 J8.1 J8.5 U13.6(CANL)
CANA_P: J8.2 J8.4 R72.2 U13.7(CANH)
CANB_N: H2.2 J9.1 J9.5 U14.6(CANL)
CANB_P: J9.2 J9.4 R74.2 U14.7(CANH)
NetH1_1: H1.1 R72.1
NetH2_1: H2.1 R74.1
NetR73_1: R73.1 U13.8(RS)
NetR75_1: R75.1 U14.8(RS)
NetU11_33: U14.4(RXD) ; port CANB_UART.CAN_RX_B
NetU11_34: U14.1(TXD) ; port CANB_UART.CAN_TX_B
NetU11_44: U13.4(RXD) ; port CANA_UART.CAN_RX_A
NetU11_45: U13.1(TXD) ; port CANA_UART.CAN_TX_A

Not connected (* = marked no-connect by the designer): U13 5(SPLIT)*; U14 5(SPLIT)*

### Layout directives
differential pair: CANA_N, CANA_P
differential pair; differential pair class CAN120: CANB_N, CANB_P

### Notes on the sheet
- CAN Transceivers
- (near J8) CAN Bus A
- (near J9) CAN Bus B
- Title:
- Project:
- Date:
- Rev:
- Reviewer:
- Engineer:
- Sheet:
- of

### Library data of the parts
C61 C62 = CAP_0.1uF_50V_0805: as C35 on sheet SH2 - 17V BUCK CONVERTER; Supplier Part Number 1: 490-8049-1-ND; Supplier 1: Digi-Key; Dielectric: X7R; LCSC Part #: C49678; Mounting Type: SMD
H1 H2 = JUMPER_2: HEADER 2X1; Manufacturer 1: TE Connectivity; Package/Footprint: TH; Supplier 1: Digi-Key; Supplier Part Number 1: A26542-ND; Mount: Through Hole; Mounting Type: TH
J8 J9 = CON_6M_SM_RA_1.5mm: CONN HEADER SMD RIGHT ANGLE 1.5 MM PITCH; Manufacturer 1: Molex; Supplier 1: Digi-Key; Supplier Part Number 1: WM12832CT-ND; Package/Footprint: SMD; Mounting Type: SMD
R72 R74 = RES_120Ω_0805_1%: as R68 on sheet SH7 - MICROCONTROLLER; Supplier Part Number 1: 541-120CCT-ND; Supplier 1: Digi-Key; LCSC Part #: C17437; Mounting Type: SMD
R73 R75 = RES_0Ω_0805: as R98 on sheet SH3 - 5V BUCK CONVERTER; Supplier Part Number 1: P0.0ACT-ND; Supplier 1: Digi-Key; LCSC Part #: C17477; Mounting Type: SMD
U13 U14 = LTC2875: IC TXRX CAN 4MBPS 8SO; Manufacturer 1: Linear Technologies; Package/Footprint: 8-SOIC; Supplier Part Number 1: LTC2875IS8#PBF-ND; Supplier 1: Digi-Key; LCSC Part #: C117076; Mounting Type: SMD